# EAGLE schematic iceberg20 (EAGLE 9.5.0)
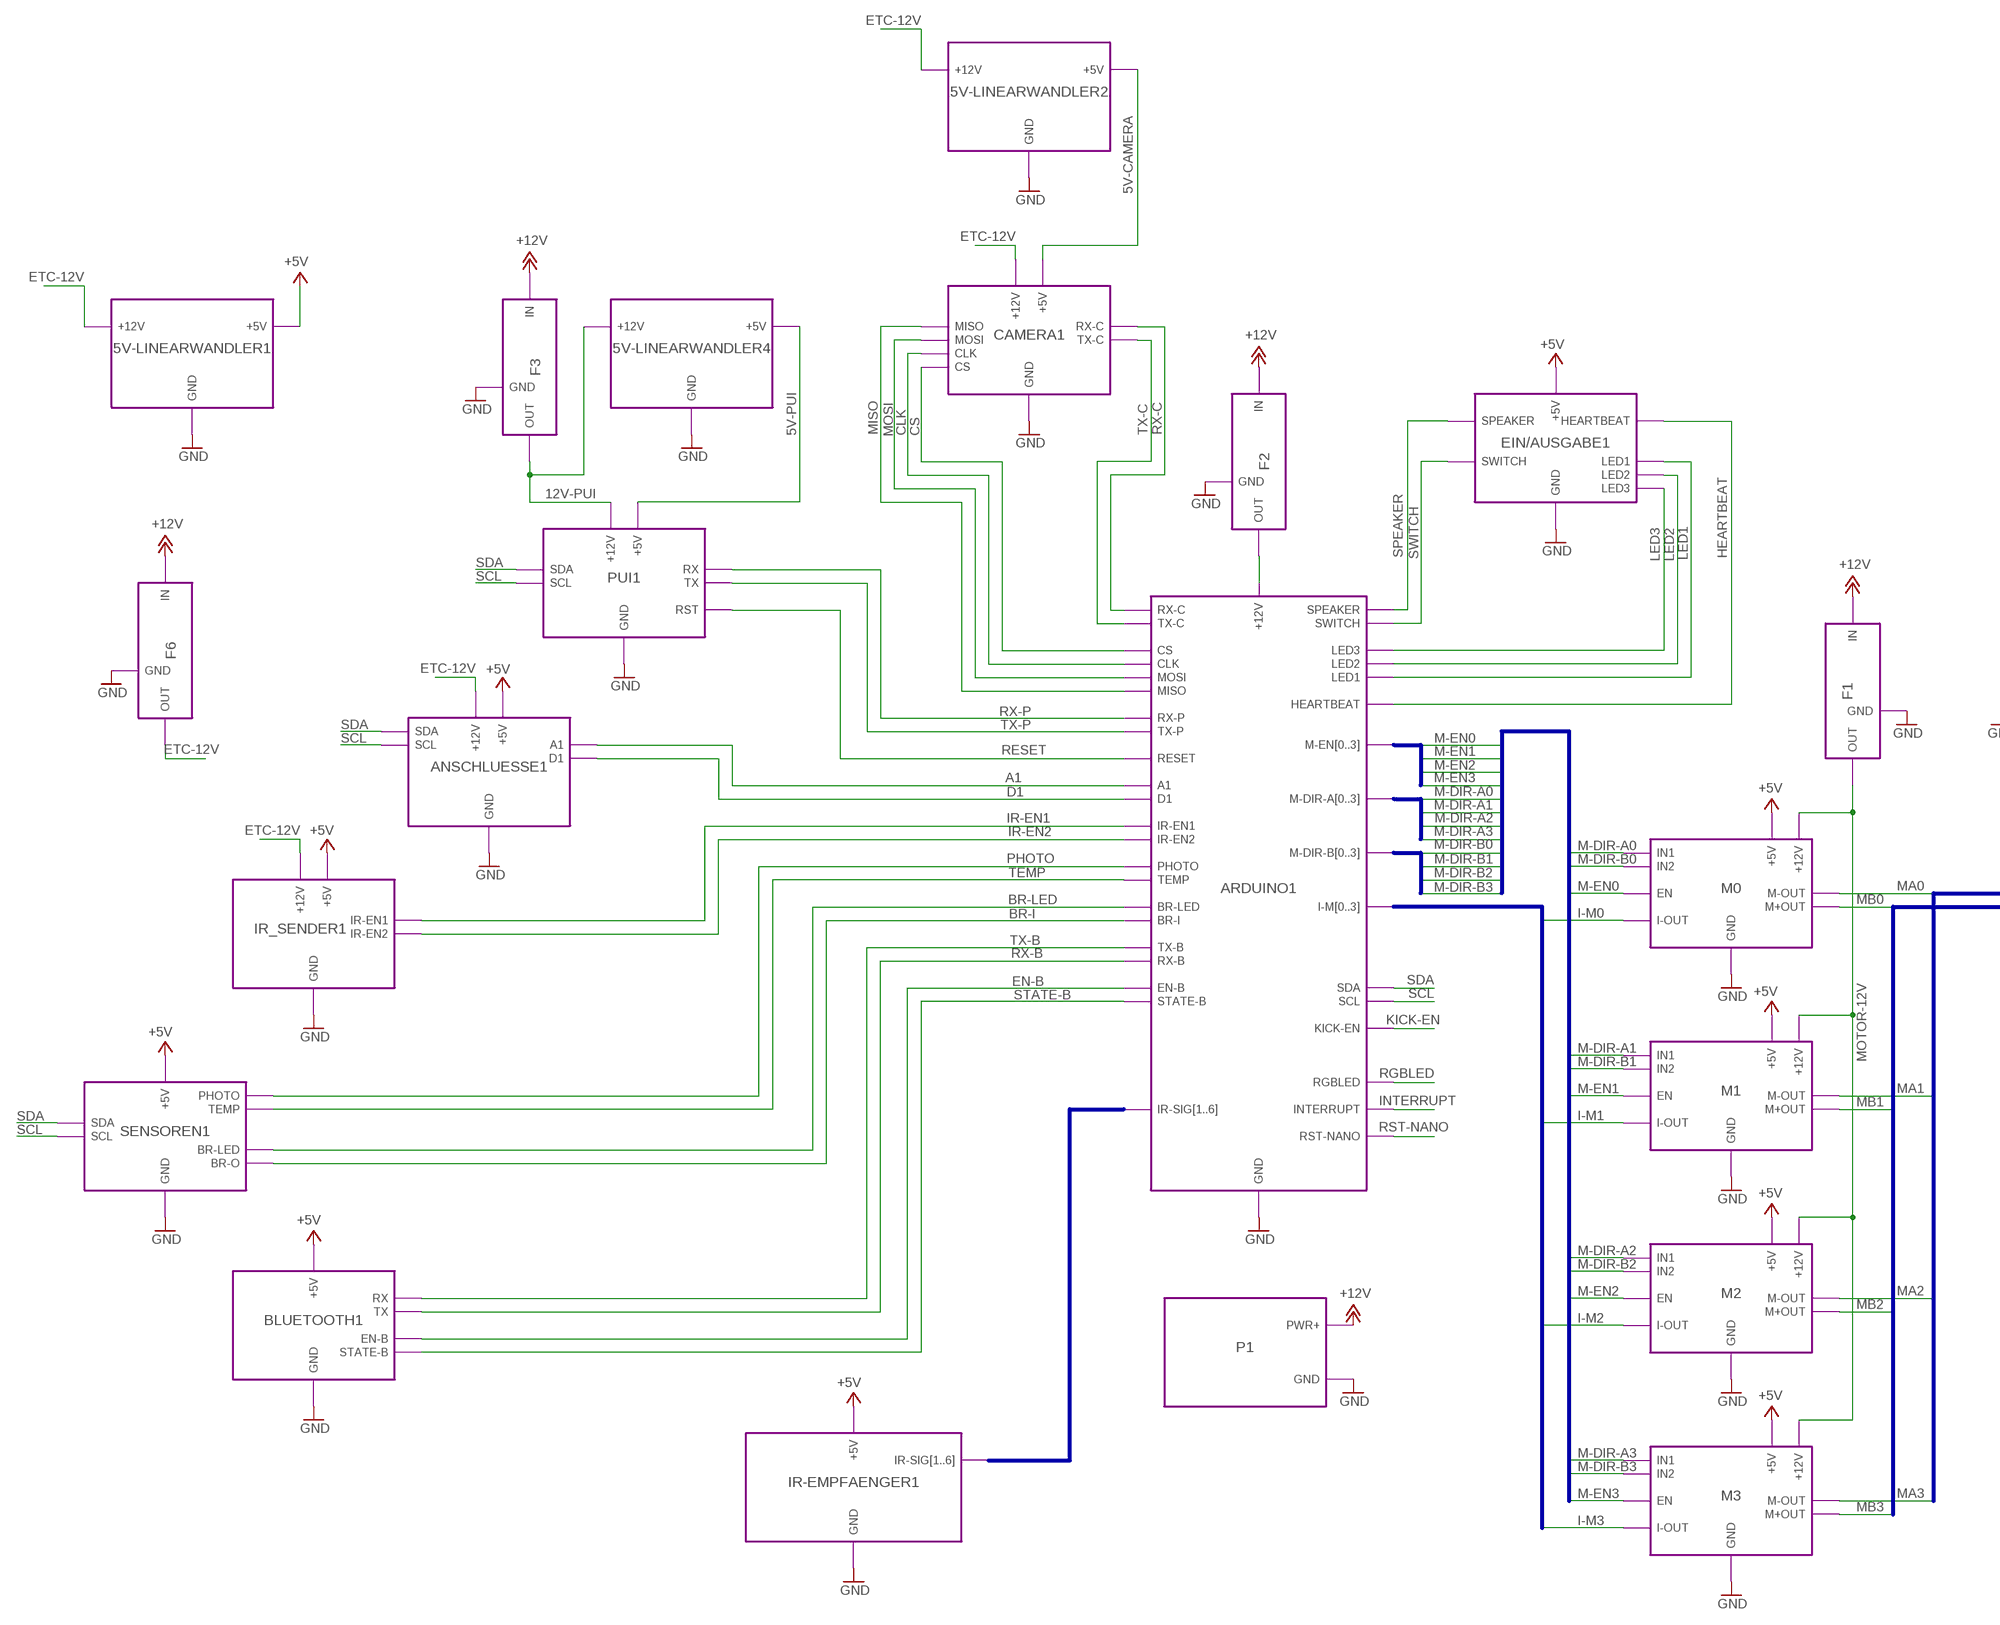
[diagram p0: schematic, sheet 1, part 1 of 2]
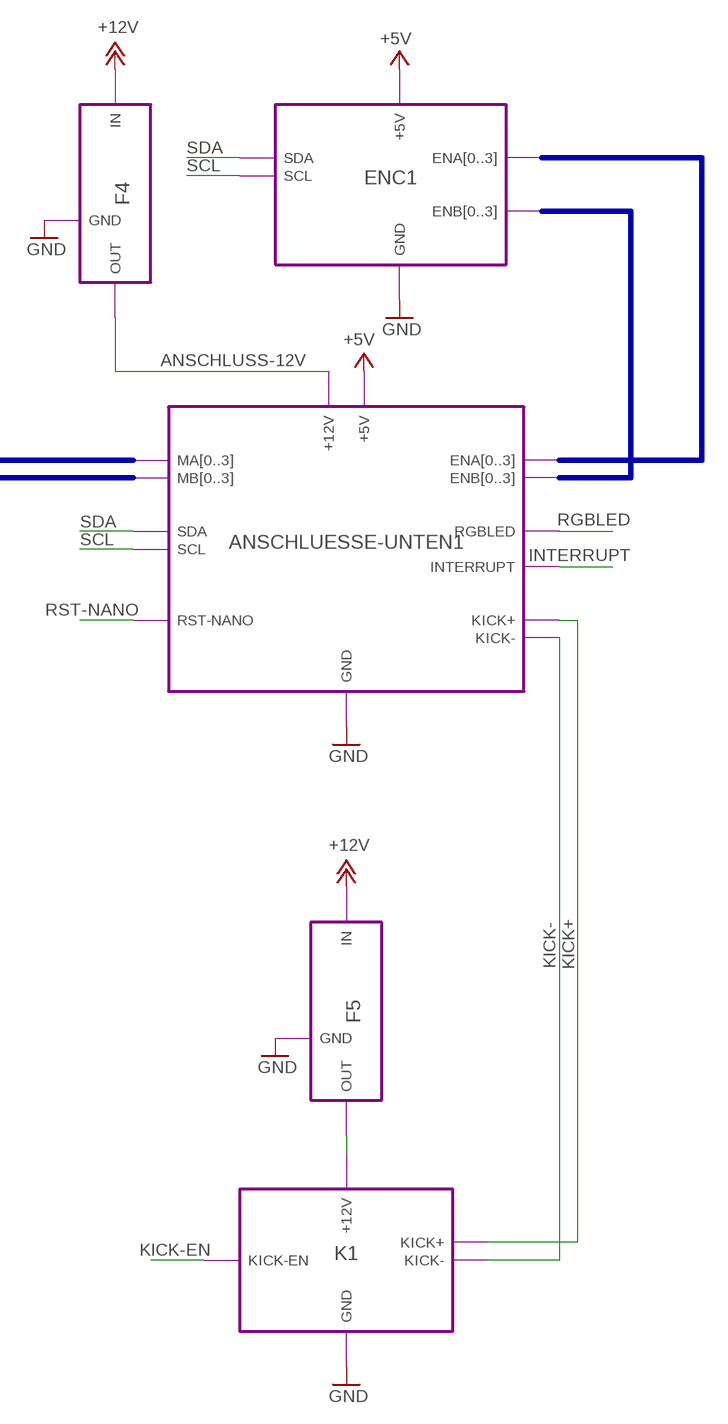
[diagram p1: schematic, sheet 1, part 2 of 2]

## Module instances
M0 = MOTOR
F1 = SICHERUNG
M1 = MOTOR
M2 = MOTOR
M3 = MOTOR
P1 = POWER
5V-LINEARWANDLER1 = 5V-LINEARWANDLER
BLUETOOTH1 = BLUETOOTH
CAMERA1 = CAMERA
IR_SENDER1 = IR-SENDER
ENC1 = ENCODER
IR-EMPFAENGER1 = IR-EMPFAENGER
K1 = KICK
PUI1 = PUI
SENSOREN1 = SENSOREN
ANSCHLUESSE-UNTEN1 = ANSCHLUESSE-UNTEN
ANSCHLUESSE1 = ANSCHLUESSE
EIN/AUSGABE1 = EIN/AUSGABE
F2 = SICHERUNG
F3 = SICHERUNG
F4 = SICHERUNG
F5 = SICHERUNG
F6 = SICHERUNG
5V-LINEARWANDLER2 = 5V-LINEARWANDLER
5V-LINEARWANDLER4 = 5V-LINEARWANDLER
ARDUINO1 = ARDUINO

## Nets
5V-CAMERA: port 5V-LINEARWANDLER2.+5V CAMERA1.+5V
5V-PUI: port 5V-LINEARWANDLER4.+5V PUI1.+5V
12V-PUI: port F3.OUT PUI1.+12V 5V-LINEARWANDLER4.+12V
+5V: port M1.+5V M2.+5V M0.+5V M3.+5V 5V-LINEARWANDLER1.+5V EIN/AUSGABE1.+5V ENC1.+5V IR-EMPFAENGER1.+5V BLUETOOTH1.+5V SENSOREN1.+5V IR_SENDER1.+5V ANSCHLUESSE1.+5V ANSCHLUESSE-UNTEN1.+5V
+12V: port P1.PWR+ F1.IN F2.IN F3.IN F4.IN F5.IN F6.IN
A1: port ARDUINO1.A1 ANSCHLUESSE1.A1
ANSCHLUSS-12V: port F4.OUT ANSCHLUESSE-UNTEN1.+12V
BR-I: port SENSOREN1.BR-O ARDUINO1.BR-I
BR-LED: port SENSOREN1.BR-LED ARDUINO1.BR-LED
CLK: port CAMERA1.CLK ARDUINO1.CLK
CS: port CAMERA1.CS ARDUINO1.CS
D1: port ARDUINO1.D1 ANSCHLUESSE1.D1
EN-B: port BLUETOOTH1.EN-B ARDUINO1.EN-B
ETC-12V: port ANSCHLUESSE1.+12V CAMERA1.+12V IR_SENDER1.+12V F6.OUT 5V-LINEARWANDLER1.+12V 5V-LINEARWANDLER2.+12V
GND: port M1.GND M2.GND F1.GND P1.GND M3.GND SENSOREN1.GND ANSCHLUESSE1.GND ANSCHLUESSE-UNTEN1.GND EIN/AUSGABE1.GND PUI1.GND K1.GND 5V-LINEARWANDLER1.GND IR-EMPFAENGER1.GND IR_SENDER1.GND CAMERA1.GND ENC1.GND BLUETOOTH1.GND M0.GND F2.GND F3.GND F4.GND F5.GND F6.GND 5V-LINEARWANDLER2.GND 5V-LINEARWANDLER4.GND ARDUINO1.GND
HEARTBEAT: port EIN/AUSGABE1.HEARTBEAT ARDUINO1.HEARTBEAT
I-M0: port M0.I-OUT
I-M1: port M1.I-OUT
I-M2: port M2.I-OUT
I-M3: port M3.I-OUT
INTERRUPT: port ANSCHLUESSE-UNTEN1.INTERRUPT ARDUINO1.INTERRUPT
IR-EN1: port IR_SENDER1.IR-EN1 ARDUINO1.IR-EN1
IR-EN2: port IR_SENDER1.IR-EN2 ARDUINO1.IR-EN2
KICK: port F5.OUT K1.+12V
KICK+: port ANSCHLUESSE-UNTEN1.KICK+ K1.KICK+
KICK-: port ANSCHLUESSE-UNTEN1.KICK- K1.KICK-
KICK-EN: port ARDUINO1.KICK-EN K1.KICK-EN
LED1: port EIN/AUSGABE1.LED1 ARDUINO1.LED1
LED2: port EIN/AUSGABE1.LED2 ARDUINO1.LED2
LED3: port EIN/AUSGABE1.LED3 ARDUINO1.LED3
M-DIR-A0: port M0.IN1
M-DIR-A1: port M1.IN1
M-DIR-A2: port M2.IN1
M-DIR-A3: port M3.IN1
M-DIR-B0: port M0.IN2
M-DIR-B1: port M1.IN2
M-DIR-B2: port M2.IN2
M-DIR-B3: port M3.IN2
M-EN0: port M0.EN
M-EN1: port M1.EN
M-EN2: port M2.EN
M-EN3: port M3.EN
MA0: port M0.M-OUT
MA1: port M1.M-OUT
MA2: port M2.M-OUT
MA3: port M3.M-OUT
MB0: port M0.M+OUT
MB1: port M1.M+OUT
MB2: port M2.M+OUT
MB3: port M3.M+OUT
MISO: port CAMERA1.MISO ARDUINO1.MISO
MOSI: port CAMERA1.MOSI ARDUINO1.MOSI
MOTOR-12V: port F1.OUT M2.+12V M3.+12V M1.+12V M0.+12V
N$38: port F2.OUT ARDUINO1.+12V
PHOTO: port SENSOREN1.PHOTO ARDUINO1.PHOTO
RESET: port PUI1.RST ARDUINO1.RESET
RGBLED: port ANSCHLUESSE-UNTEN1.RGBLED ARDUINO1.RGBLED
RST-NANO: port ARDUINO1.RST-NANO ANSCHLUESSE-UNTEN1.RST-NANO
RX-B: port BLUETOOTH1.TX ARDUINO1.RX-B
RX-C: port CAMERA1.RX-C ARDUINO1.RX-C
RX-P: port PUI1.RX ARDUINO1.RX-P
SCL: port ENC1.SCL SENSOREN1.SCL ANSCHLUESSE1.SCL ANSCHLUESSE-UNTEN1.SCL PUI1.SCL ARDUINO1.SCL
SDA: port ENC1.SDA SENSOREN1.SDA ANSCHLUESSE1.SDA ANSCHLUESSE-UNTEN1.SDA PUI1.SDA ARDUINO1.SDA
SPEAKER: port EIN/AUSGABE1.SPEAKER ARDUINO1.SPEAKER
STATE-B: port ARDUINO1.STATE-B BLUETOOTH1.STATE-B
SWITCH: port EIN/AUSGABE1.SWITCH ARDUINO1.SWITCH
TEMP: port ARDUINO1.TEMP SENSOREN1.TEMP
TX-B: port BLUETOOTH1.RX ARDUINO1.TX-B
TX-C: port CAMERA1.TX-C ARDUINO1.TX-C
TX-P: port PUI1.TX ARDUINO1.TX-P

## Buses
MB[0..3]
ENA[0..3]
ENB[0..3]
MA[0..3]
IR-SIG[1..6]
M-EN[0..3]
M-DIR-A[0..3]
M-DIR-A[0..3],M-DIR-B[0..3],M-EN[0..3]
I-M[0..3]
M-DIR-B[0..3]

## Library data of the parts

## Module MOTOR
Ports: +12V(pwr) +5V(pwr) IN1(in) IN2(in) EN(in) GND(pwr) I-OUT(out) M-OUT(out) M+OUT(out)
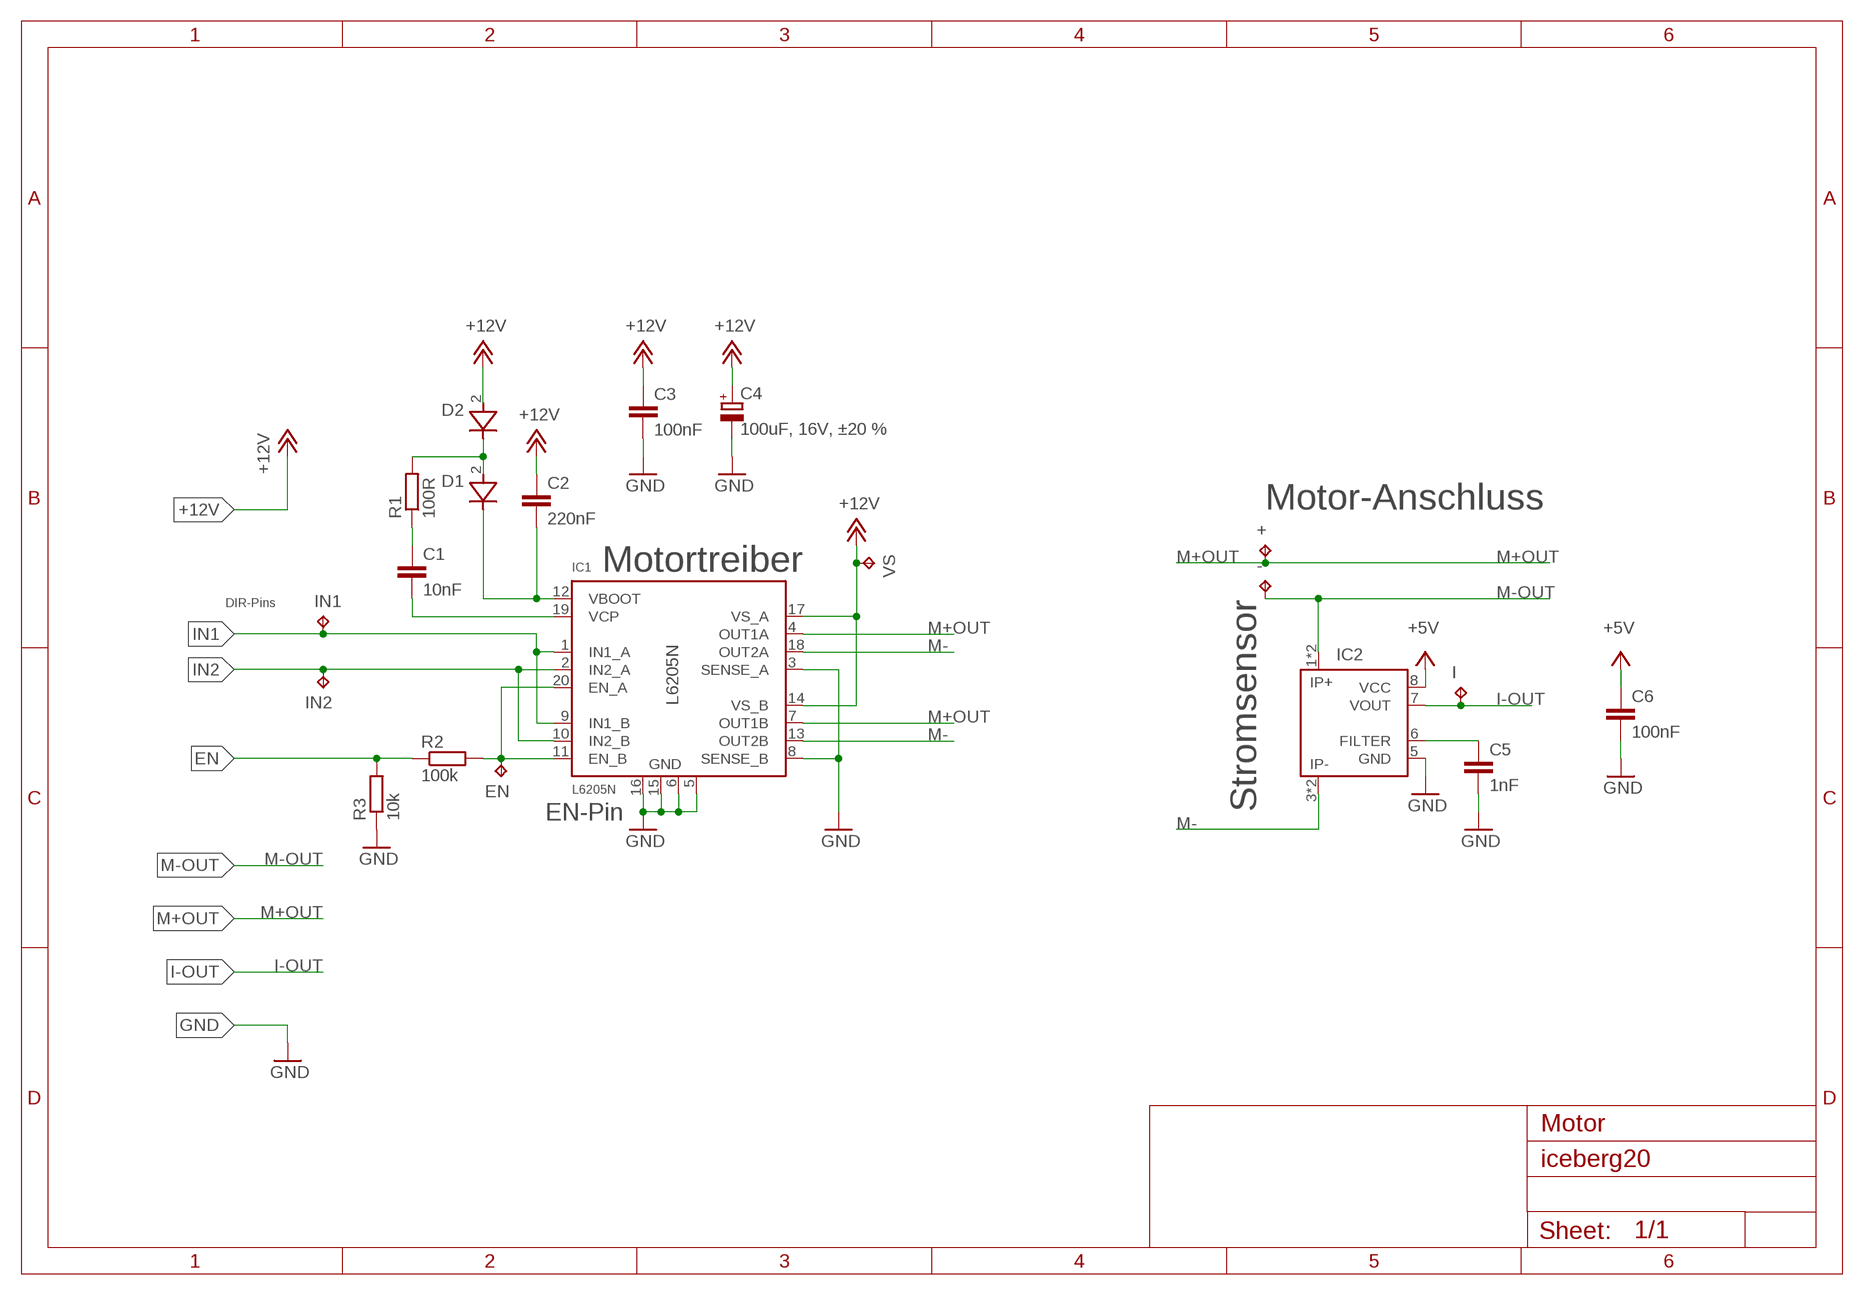
[diagram p2: schematic, module MOTOR, sheet 1]

### Parts
+  TESTPAD  [TESTPAD_B2,54]
-  TESTPAD  [TESTPAD_B2,54]
C1  10nF  C0805  [C0805]
C2  220nF  C0805  [C0805]
C3  100nF  C0805  [C0805]
C4  100uF, 16V, ±20 %  ELKO-THT-100UF  [CAPACITOR-THT-6.3]
C5  1nF  C0805  [C0805]
C6  100nF  C0805  [C0805]
D1  DIODE  [DO-214BA]
D2  DIODE  [DO-214BA]
EN  TESTPAD  [TESTPAD_B2,54]
I  TESTPAD  [TESTPAD_B2,54]
IC1  L6205N  [DIL20]
IC2  ACS712ACS712-SOIC-8  [SOIC-8]
IN1  TESTPAD  [TESTPAD_B2,54]
IN2  TESTPAD  [TESTPAD_B2,54]
R1  100R  R  [R0805]
R2  100k  R  [R0805]
R3  10k  R  [R0805]
VS  TESTPAD  [TESTPAD_B2,54]

### Nets
+5V: C6.1 IC2.8(VCC)
+12V [4A]: C2.1 C3.1 C4.1(+) D2.2(A) IC1.14(VS_B) IC1.17(VS_A) VS.TP
EN: R2.1 R3.2
FILTER: C5.1 IC2.6(FILTER)
GND [4A]: C3.2 C4.2(-) C5.2 C6.2 IC1.3(SENSE_A) IC1.5(GND) IC1.6(GND) IC1.8(SENSE_B) IC1.15(GND) IC1.16(GND) IC2.5(GND) R3.1
I-OUT: I.TP IC2.7(VOUT)
IN1 [signal]: IC1.1(IN1_A) IC1.9(IN1_B) IN1.TP
IN2 [signal]: IC1.2(IN2_A) IC1.10(IN2_B) IN2.TP
M+OUT: +.TP IC1.4(OUT1A) IC1.7(OUT1B)
M- [4A]: IC1.13(OUT2B) IC1.18(OUT2A) IC2.3(IP-) IC2.4(IP-)
M-OUT: -.TP IC2.1(IP+) IC2.2(IP+)
N$4: D1.2(A) D2.1(C) R1.2
N$6: C2.2 D1.1(C) IC1.12(VBOOT)
N$7: C1.1 R1.1
N$8: C1.2 IC1.19(VCP)
N$9: EN.TP IC1.11(EN_B) IC1.20(EN_A) R2.2

### Notes on the sheet
- Motor-Anschluss
- Motortreiber
- DIR-Pins
- Stromsensor
- EN-Pin
- Motor

### Library data of the parts
+ - EN I IN1 IN2 VS = iceberg20:TESTPAD: Testpad; BESTAND: -; HERSTELLER: -; HERSTELLER-NR: -; SUPPLIER: -; SUPPLIER-NR: -
C1-C3 C5 C6 = iceberg20:C: Capacitor, SMD 0805, Value wird festgelegt; BESTAND: -; HERSTELLER: -; HERSTELLER-NR: -; SUPPLIER: -; SUPPLIER-NR: -; TOLERANZ: 10%; V-MAX: 20V
C4 = iceberg20:ELKO: Aluminium-Elko 4,7 µF, 16 V, ±20%, 3x5 mm Datenblatt: Link <https://https://www.buerklin.com/medias/sys_master/root/hc1/h62/8875244388382/8875244388382.pdf>; BESTAND: 10; HERSTELLER: Teapo; HERSTELLER-NR: KSE107M016S1ABE11K; SUPPLIER: Bürklin; SUPPLIER-NR: 11D5002
D1 D2 = iceberg20:DIODE: SMD-Gleichrichter-Diode, 50 V, 1 A, DO214BA Datenblatt: Link <https://www.buerklin.com/medias/sys_master/root/h18/hbc/8865944993822/8865944993822.pdf>; BESTAND: 0; HERSTELLER: Vishay; HERSTELLER-NR: 9DRGF1A67A; SUPPLIER: Bürklin; SUPPLIER-NR: 26S9150
IC1 = iceberg20:L6205: Brückentreiber, 8V - 52VDatenblatt: Link <https://cdn-reichelt.de/documents/datenblatt/A200/DS_L6205N.pdf>; BESTAND: ?; HERSTELLER: ST MICROELECTRONICS; HERSTELLER-NR: L6205N; SUPPLIER: reichelt; SUPPLIER-NR: L 6205 N
IC2 = iceberg20:ACS712: Stromsensor AC/DC, 5 V Datenblatt: Link <https://cdn-reichelt.de/documents/datenblatt/A200/ACS712.pdf>; BESTAND: ?; HERSTELLER: ALLEGRO; HERSTELLER-NR: ACS712ELCTR-05B-T; SUPPLIER: reichelt; SUPPLIER-NR: ACS712 ELCTR-05
R1-R3 = iceberg20:R: Resistor, SMD 0805, Value wird festgelegt; BESTAND: -; HERSTELLER: -; HERSTELLER-NR: -; SUPPLIER: -; SUPPLIER-NR: -; TOLERANZ: 5%

## Module SICHERUNG
Ports: IN(in) OUT(out) GND(pwr)
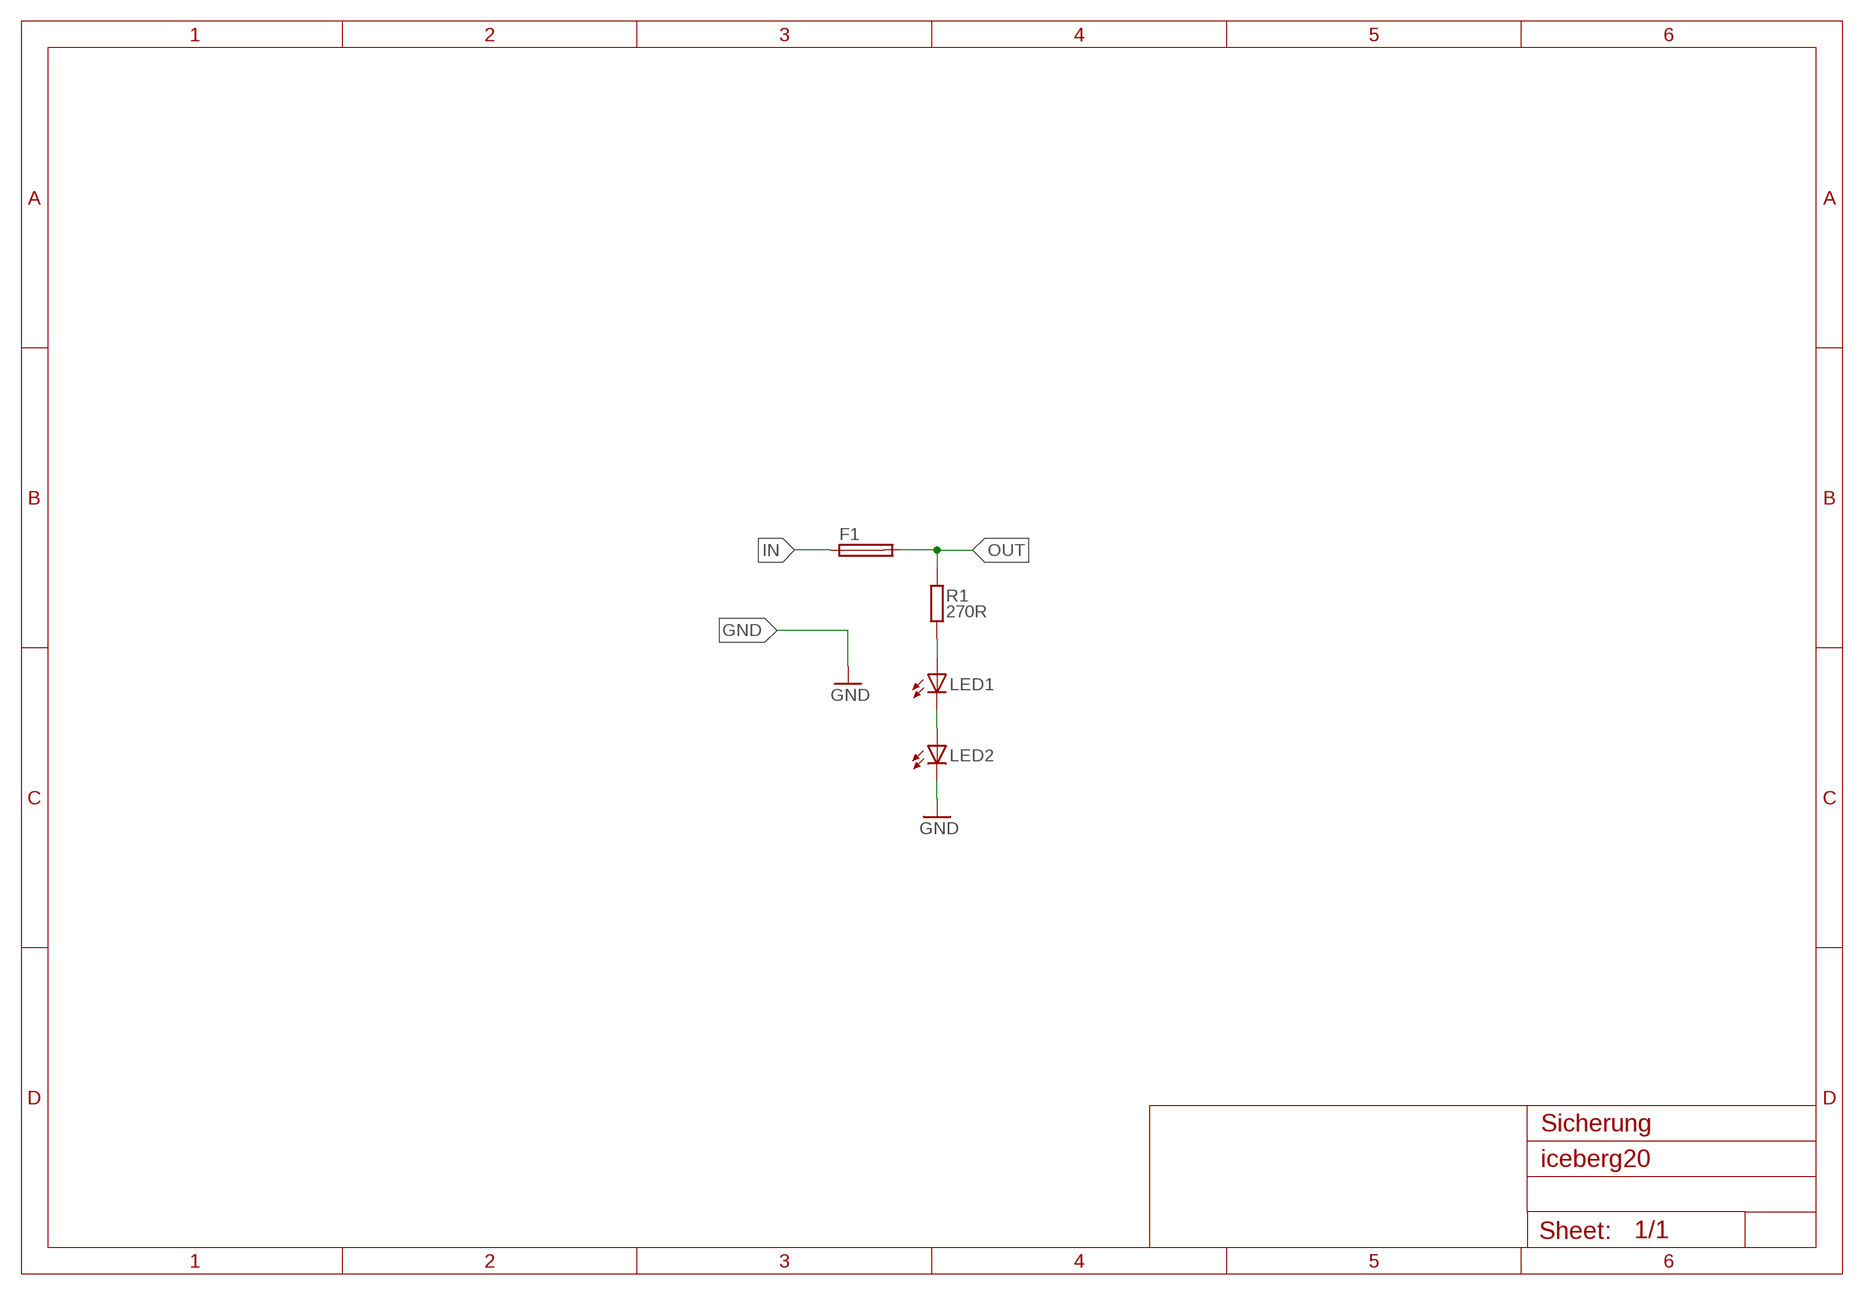
[diagram p3: schematic, module SICHERUNG, sheet 1]

### Parts
F1  SICHERUNGSHALTER  [SH22,5]
LED1  LED-GREEN1  [1206]
LED2  LED-GREEN1  [1206]
R1  270R  R  [R0805]

### Nets
GND [4A]: LED2.C
IN: F1.1
N$1: LED1.A R1.1
N$165: LED1.C LED2.A
OUT: F1.2 R1.2

### Notes on the sheet
- Sicherung

### Library data of the parts
F1 = iceberg20:SICHERUNGSHALTER: Sicherungshalter, 250 V, 10 A Datenblatt: Link <https://www.buerklin.com/medias/sys_master/root/he1/h38/8868100440094/8868100440094.pdf>; BESTAND: ?; HERSTELLER: SCHURTER; HERSTELLER-NR: 0031.8201; SUPPLIER: Bürklin; SUPPLIER-NR: 46G6020
LED1 LED2 = iceberg20:LED-GREEN1: LED Green, 1206Datenblatt: Link <https://www.buerklin.com/medias/sys_master/root/h40/hdf/8866310357022/8866310357022.pdf>; HERSTELLER: EVERLIGHT; HERSTELLER-NR: 15-21SYGC/S530-E1/TR8 Everlight; SUPPLIER: Bürklin; SUPPLIER-NR: 67S2004
R1 = iceberg20:R: Resistor, SMD 0805, Value wird festgelegt; BESTAND: -; HERSTELLER: -; HERSTELLER-NR: -; SUPPLIER: -; SUPPLIER-NR: -; TOLERANZ: 5%

## Module ARDUINO
Ports: +12V(pwr) GND(pwr) A1(io) D1(io) SDA(io) SCL(io) KICK-EN(out) RX-P(in) TX-P(out) RESET(in) RX-B(in) TX-B(out) RX-C(in) TX-C(out) MISO(in) MOSI(out) CLK(io) CS(out) HEARTBEAT(out) IR-EN1(out) IR-EN2(out) BR-LED(out) BR-I(in) IR-SIG[1..6](in) M-EN[0..3](out) M-DIR-A[0..3](out) M-DIR-B[0..3](out) I-M[0..3](in) RGBLED(out) INTERRUPT(in) RST-NANO(out) PHOTO(in) TEMP(in) EN-B(out) STATE-B(in) SPEAKER(out) SWITCH(in) LED3(out) LED2(out) LED1(out)
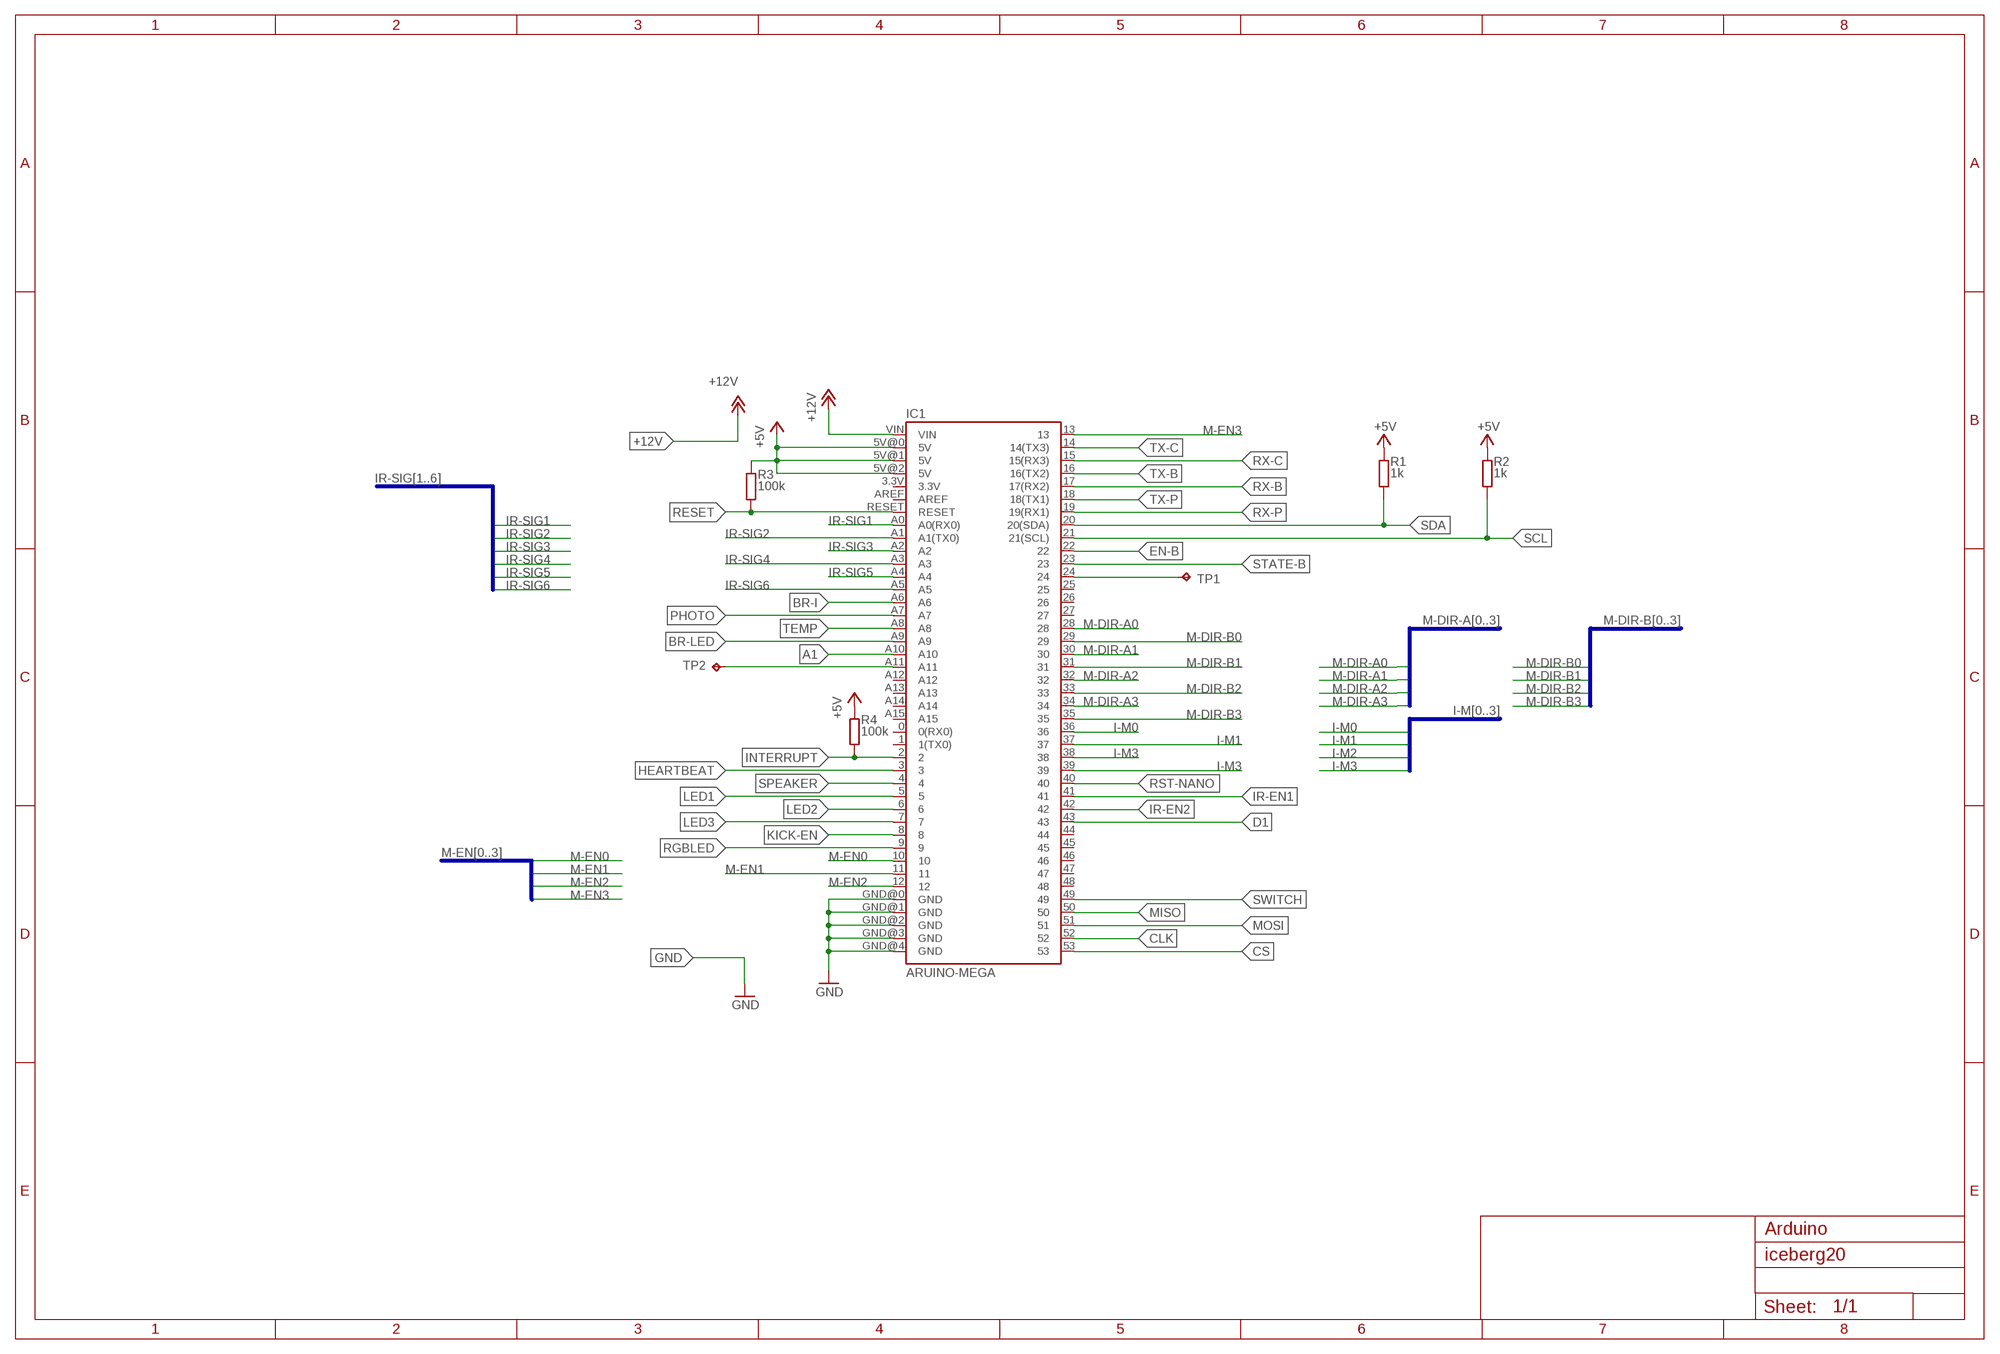
[diagram p4: schematic, module ARDUINO, sheet 1]

### Parts
IC1  ARUINO-MEGA  [ARDUINO_MEGA]
R1  1k  R  [R0805]
R2  1k  R  [R0805]
R3  100k  R  [R0805]
R4  100k  R  [R0805]
TP1  TESTPAD  [TESTPAD_B2,54]
TP2  TESTPAD  [TESTPAD_B2,54]

### Nets
+5V: IC1.5V@0(5V) IC1.5V@1(5V) IC1.5V@2(5V) R1.2 R2.2 R3.2 R4.2
+12V: IC1.VIN
A1: IC1.A10
BR-I: IC1.A6
BR-LED: IC1.A9
CLK: IC1.52
CS: IC1.53
D1: IC1.43
EN-B: IC1.22
GND: IC1.GND@0(GND) IC1.GND@1(GND) IC1.GND@2(GND) IC1.GND@3(GND) IC1.GND@4(GND)
HEARTBEAT: IC1.3
I-M0: IC1.36
I-M1: IC1.37
I-M3: IC1.38 IC1.39
INTERRUPT: IC1.2 R4.1
IR-EN1: IC1.41
IR-EN2: IC1.42
IR-SIG1: IC1.A0(A0(RX0))
IR-SIG2: IC1.A1(A1(TX0))
IR-SIG3: IC1.A2
IR-SIG4: IC1.A3
IR-SIG5: IC1.A4
IR-SIG6: IC1.A5
KICK-EN: IC1.8
LED1: IC1.5
LED2: IC1.6
LED3: IC1.7
M-DIR-A0: IC1.28
M-DIR-A1: IC1.30
M-DIR-A2: IC1.32
M-DIR-A3: IC1.34
M-DIR-B0: IC1.29
M-DIR-B1: IC1.31
M-DIR-B2: IC1.33
M-DIR-B3: IC1.35
M-EN0: IC1.10
M-EN1: IC1.11
M-EN2: IC1.12
M-EN3: IC1.13
MISO: IC1.50
MOSI: IC1.51
N$1: IC1.A11 TP2.TP
N$2: IC1.24 TP1.TP
PHOTO: IC1.A7
RESET: IC1.RESET R3.1
RGBLED: IC1.9
RST-NANO: IC1.40
RX-B: IC1.17(17(RX2))
RX-C: IC1.15(15(RX3))
RX-P: IC1.19(19(RX1))
SCL: IC1.21(21(SCL)) R2.1
SDA: IC1.20(20(SDA)) R1.1
SPEAKER: IC1.4
STATE-B: IC1.23
SWITCH: IC1.49
TEMP: IC1.A8
TX-B: IC1.16(16(TX2))
TX-C: IC1.14(14(TX3))
TX-P: IC1.18(18(TX1))
Unconnected: IC1.0(0(RX0)) IC1.1(1(TX0)) IC1.3.3V IC1.25 IC1.26 IC1.27 IC1.44 IC1.45 IC1.46 IC1.47 IC1.48 IC1.A12 IC1.A13 IC1.A14 IC1.A15 IC1.AREF

### Buses
IR-SIG[1..6]
M-DIR-A[0..3]
M-DIR-B[0..3]
I-M[0..3]
M-EN[0..3]

### Notes on the sheet
- Arduino

### Library data of the parts
IC1 = iceberg20:ARUINO-MEGA: Arudino Mega 2560, 7-12V Datenblatt: Link <https://store.arduino.cc/mega-2560-r3>; BESTAND: 4; HERSTELLER: Arduino; HERSTELLER-NR: Arduino Mega 2560; SUPPLIER: Makerstore; SUPPLIER-NR: Arduino Mega 2650
R1-R4 = iceberg20:R: Resistor, SMD 0805, Value wird festgelegt; BESTAND: -; HERSTELLER: -; HERSTELLER-NR: -; SUPPLIER: -; SUPPLIER-NR: -; TOLERANZ: 5%
TP1 TP2 = iceberg20:TESTPAD: Testpad; BESTAND: -; HERSTELLER: -; HERSTELLER-NR: -; SUPPLIER: -; SUPPLIER-NR: -

## Module POWER
Ports: PWR+(pwr) GND(pwr)
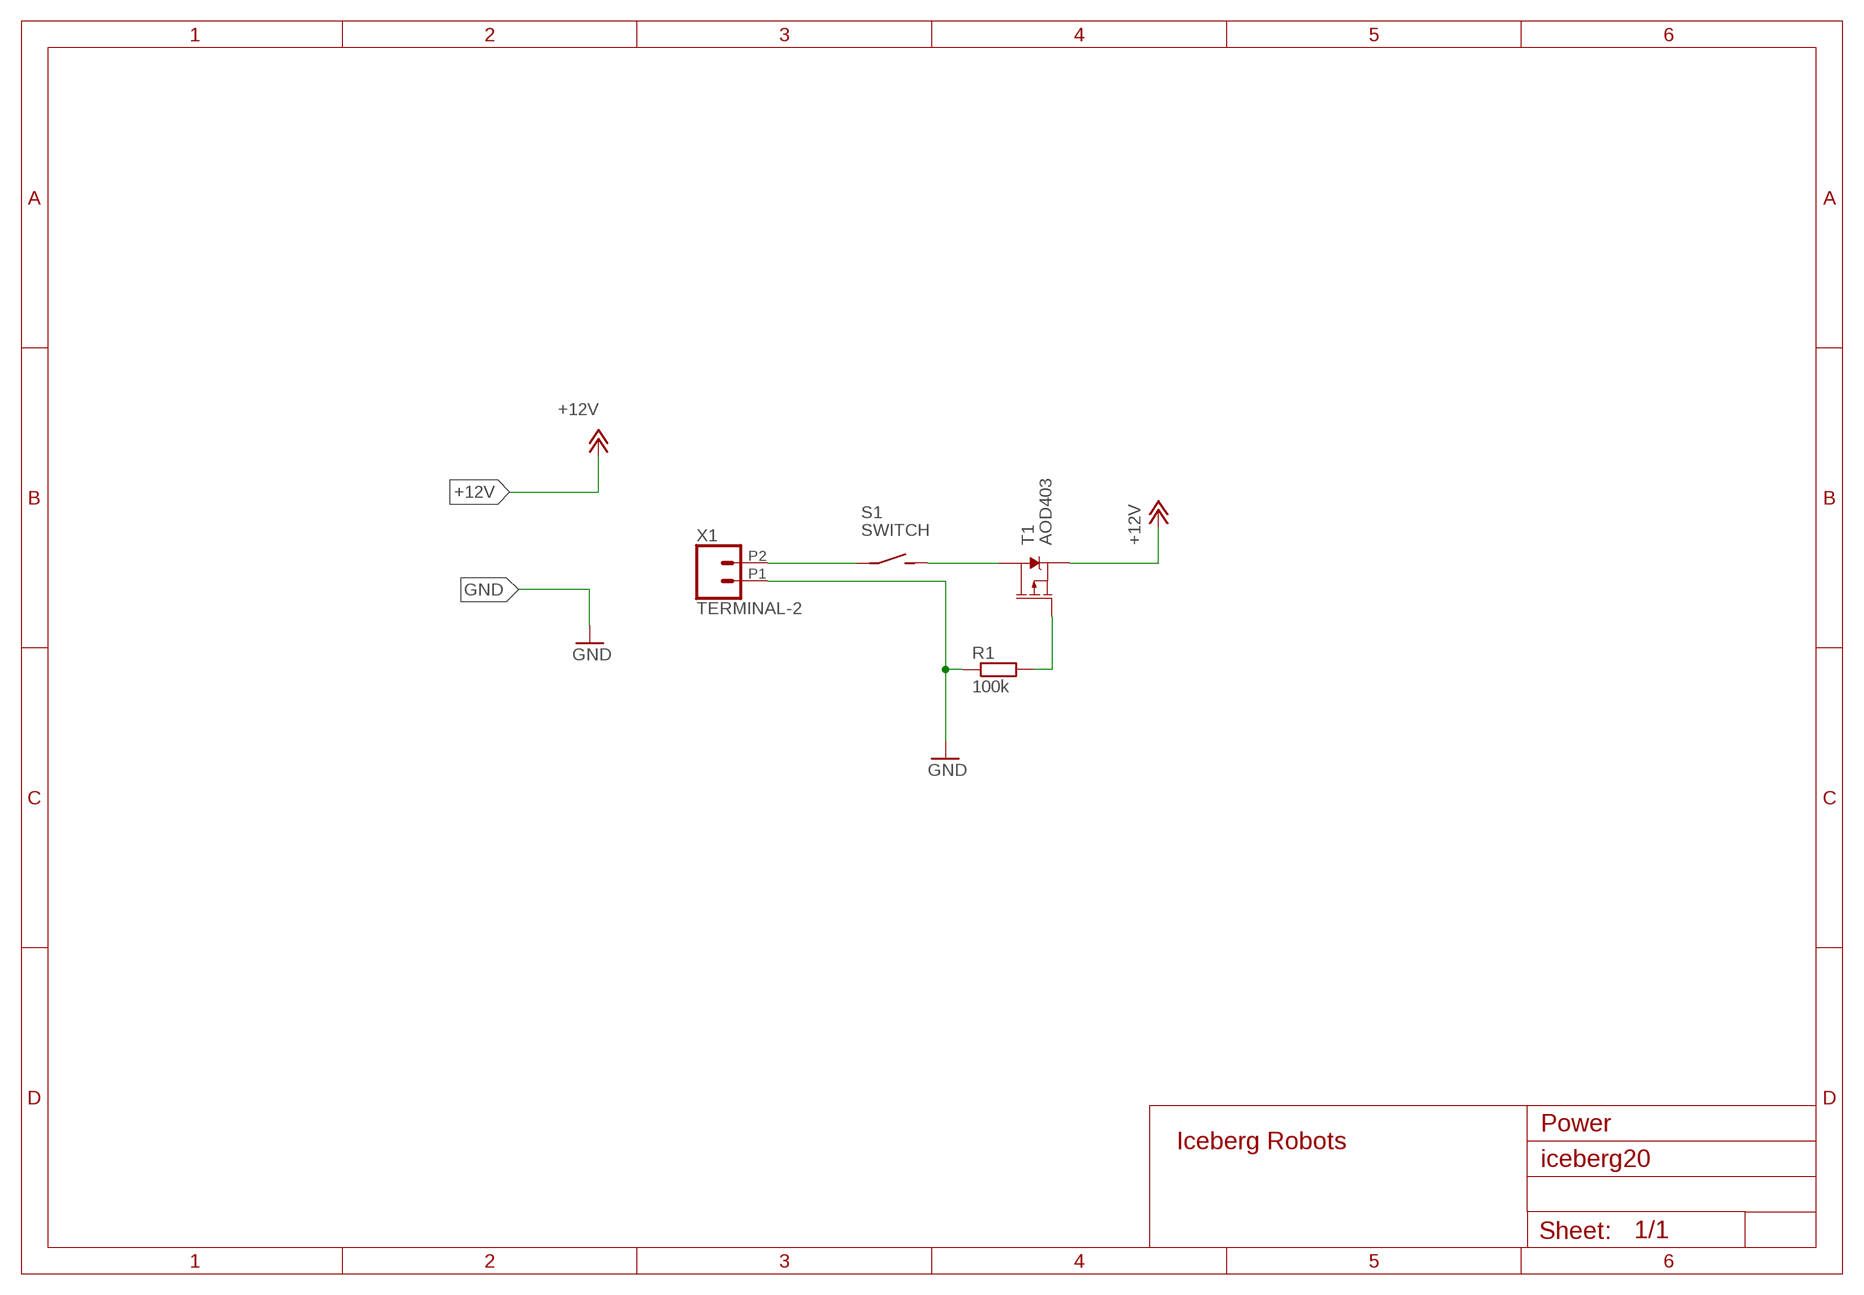
[diagram p5: schematic, module POWER, sheet 1]

### Parts
R1  100k  R  [R0805]
S1  SWITCH  [1801.2106]
T1  AOD403  [TO252]
X1  TERMINAL-2  [LIB_WECO121]

### Nets
+12V: T1.2(S)
GND: R1.1 X1.P1
N$1: S1.1(P) X1.P2
N$2: S1.2(S) T1.3(D)
N$4: R1.2 T1.1(G)

### Notes on the sheet
- Power

### Library data of the parts
R1 = iceberg20:R: Resistor, SMD 0805, Value wird festgelegt; BESTAND: -; HERSTELLER: -; HERSTELLER-NR: -; SUPPLIER: -; SUPPLIER-NR: -; TOLERANZ: 5%
S1 = iceberg20:SWITCH: Wippausschalter, schwarz, 1-polig, Ein-Aus Datenblatt: Link <https://www.buerklin.com/medias/sys_master/root/h4c/ha7/8865562296350/8865562296350.pdf>; BESTAND: 1; HERSTELLER: Marquardt; HERSTELLER-NR: 1801.2106; SUPPLIER: Bürklin; SUPPLIER-NR: 11G2420
T1 = iceberg20:AOD403: AO D403 MOSFET, P-CH, 30V, 70A, 90W, DPAK Datenblatt: Link <https://cdn-reichelt.de/documents/datenblatt/A100/AOD403_SPEC.pdf> Zeichnung: Link <http://www.aosmd.com/res/packaging_information/TO252.pdf>; BESTAND: 0; HERSTELLER: Alpha & Omega; HERSTELLER-NR: AOD403; SUPPLIER: Reichelt; SUPPLIER-NR: AO D403
X1 = iceberg20:TERMINAL-2: Stiftleiste, Stift, 2-polig, 5 mm Datenblatt: Link <https://www.buerklin.com/medias/sys_master/root/h54/h05/8866138259486/8866138259486.pdf>; HERSTELLER: Weco; HERSTELLER-NR: 20806102 121-M-121/02-K; SUPPLIER: Bürklin; SUPPLIER-NR: 47F1100

## Module KICK
Ports: +12V(pwr) GND(pwr) KICK+(io) KICK-(io) KICK-EN(io)
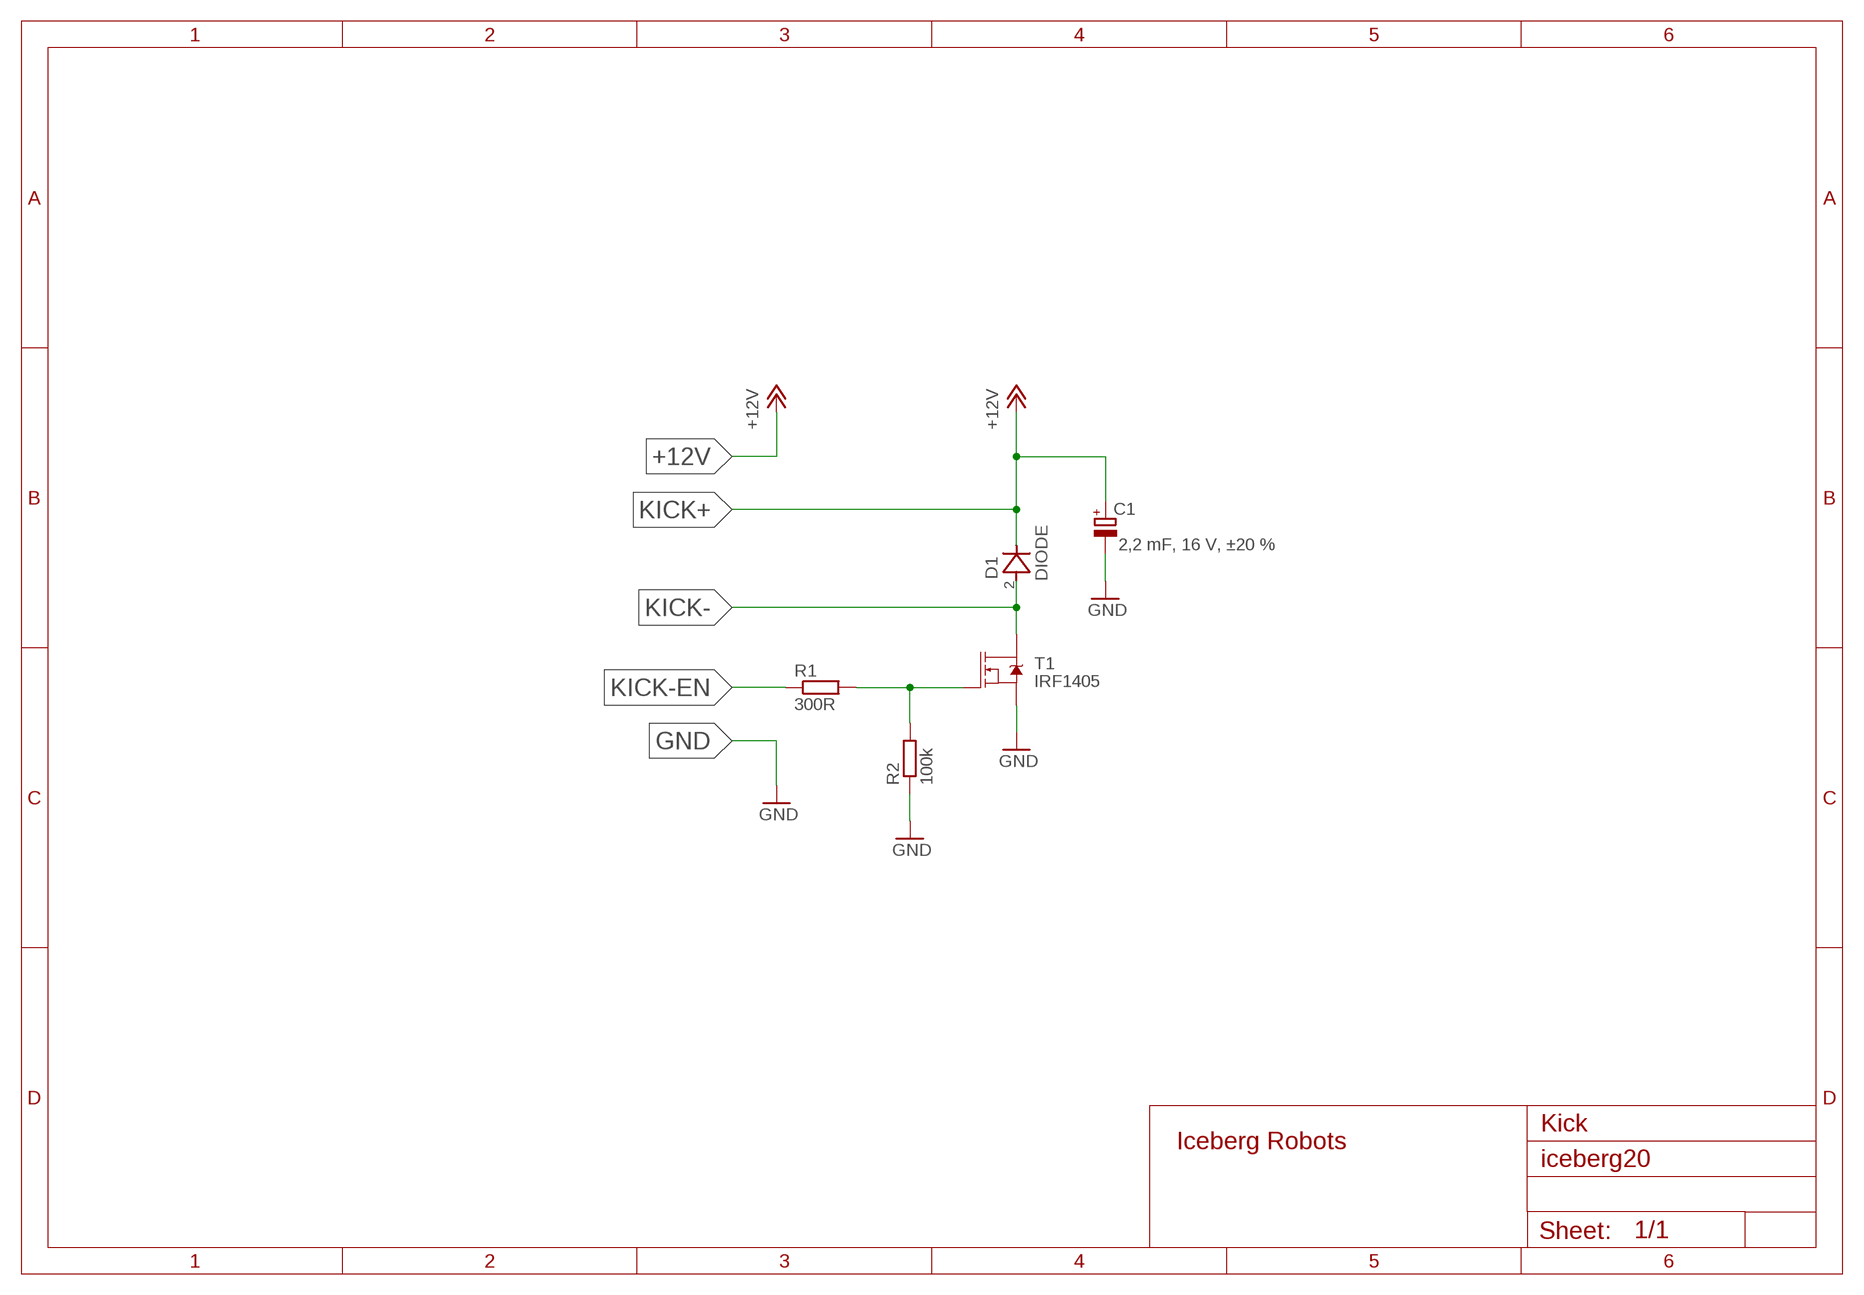
[diagram p6: schematic, module KICK, sheet 1]

### Parts
C1  2,2 mF, 16 V, ±20 %  ELKO-THT-2200UF  [CAPACITOR-THT-13]
D1  DIODE  [DO-214BA]
R1  300R  R  [R0805]
R2  100k  R  [R0805]
T1  IRF1405  [TO220V]

### Nets
GND: C1.2(-) R2.1 T1.3(S)
KICK+: C1.1(+) D1.1(C) ; supply symbol labelled +12V
KICK-: D1.2(A) T1.2(D)
KICK-EN: R1.1
N$1: R1.2 R2.2 T1.1(G)

### Notes on the sheet
- Kick

### Library data of the parts
C1 = iceberg20:ELKO: Aluminium-Elko 4,7 µF, 16 V, ±20%, 3x5 mm Datenblatt: Link <https://https://www.buerklin.com/medias/sys_master/root/hc1/h62/8875244388382/8875244388382.pdf>; BESTAND: ?; HERSTELLER: Teapo; HERSTELLER-NR: KSY228M016S1A5L25K SY2200UF/16V; SUPPLIER: Bürklin; SUPPLIER-NR: 11D5156
D1 = iceberg20:DIODE: SMD-Gleichrichter-Diode, 50 V, 1 A, DO214BA Datenblatt: Link <https://www.buerklin.com/medias/sys_master/root/h18/hbc/8865944993822/8865944993822.pdf>; BESTAND: 0; HERSTELLER: Vishay; HERSTELLER-NR: 9DRGF1A67A; SUPPLIER: Bürklin; SUPPLIER-NR: 26S9150
R1 R2 = iceberg20:R: Resistor, SMD 0805, Value wird festgelegt; BESTAND: -; HERSTELLER: -; HERSTELLER-NR: -; SUPPLIER: -; SUPPLIER-NR: -; TOLERANZ: 5%
T1 = iceberg20:IRF1405: MOSFET IRF1405PBF, N-Chanel, 169 A, THT Datenblatt: Link <https://www.buerklin.com/medias/sys_master/root/hcd/h0f/8874953441310/8874953441310.pdf/>; BESTAND: 3; HERSTELLER: IOR; HERSTELLER-NR: IRF1405PBF; SUPPLIER: Bürklin; SUPPLIER-NR: 31S3068

## Module PUI
Ports: +5V(pwr) +12V(pwr) GND(pwr) SDA(io) SCL(io) RX(in) TX(out) RST(out)
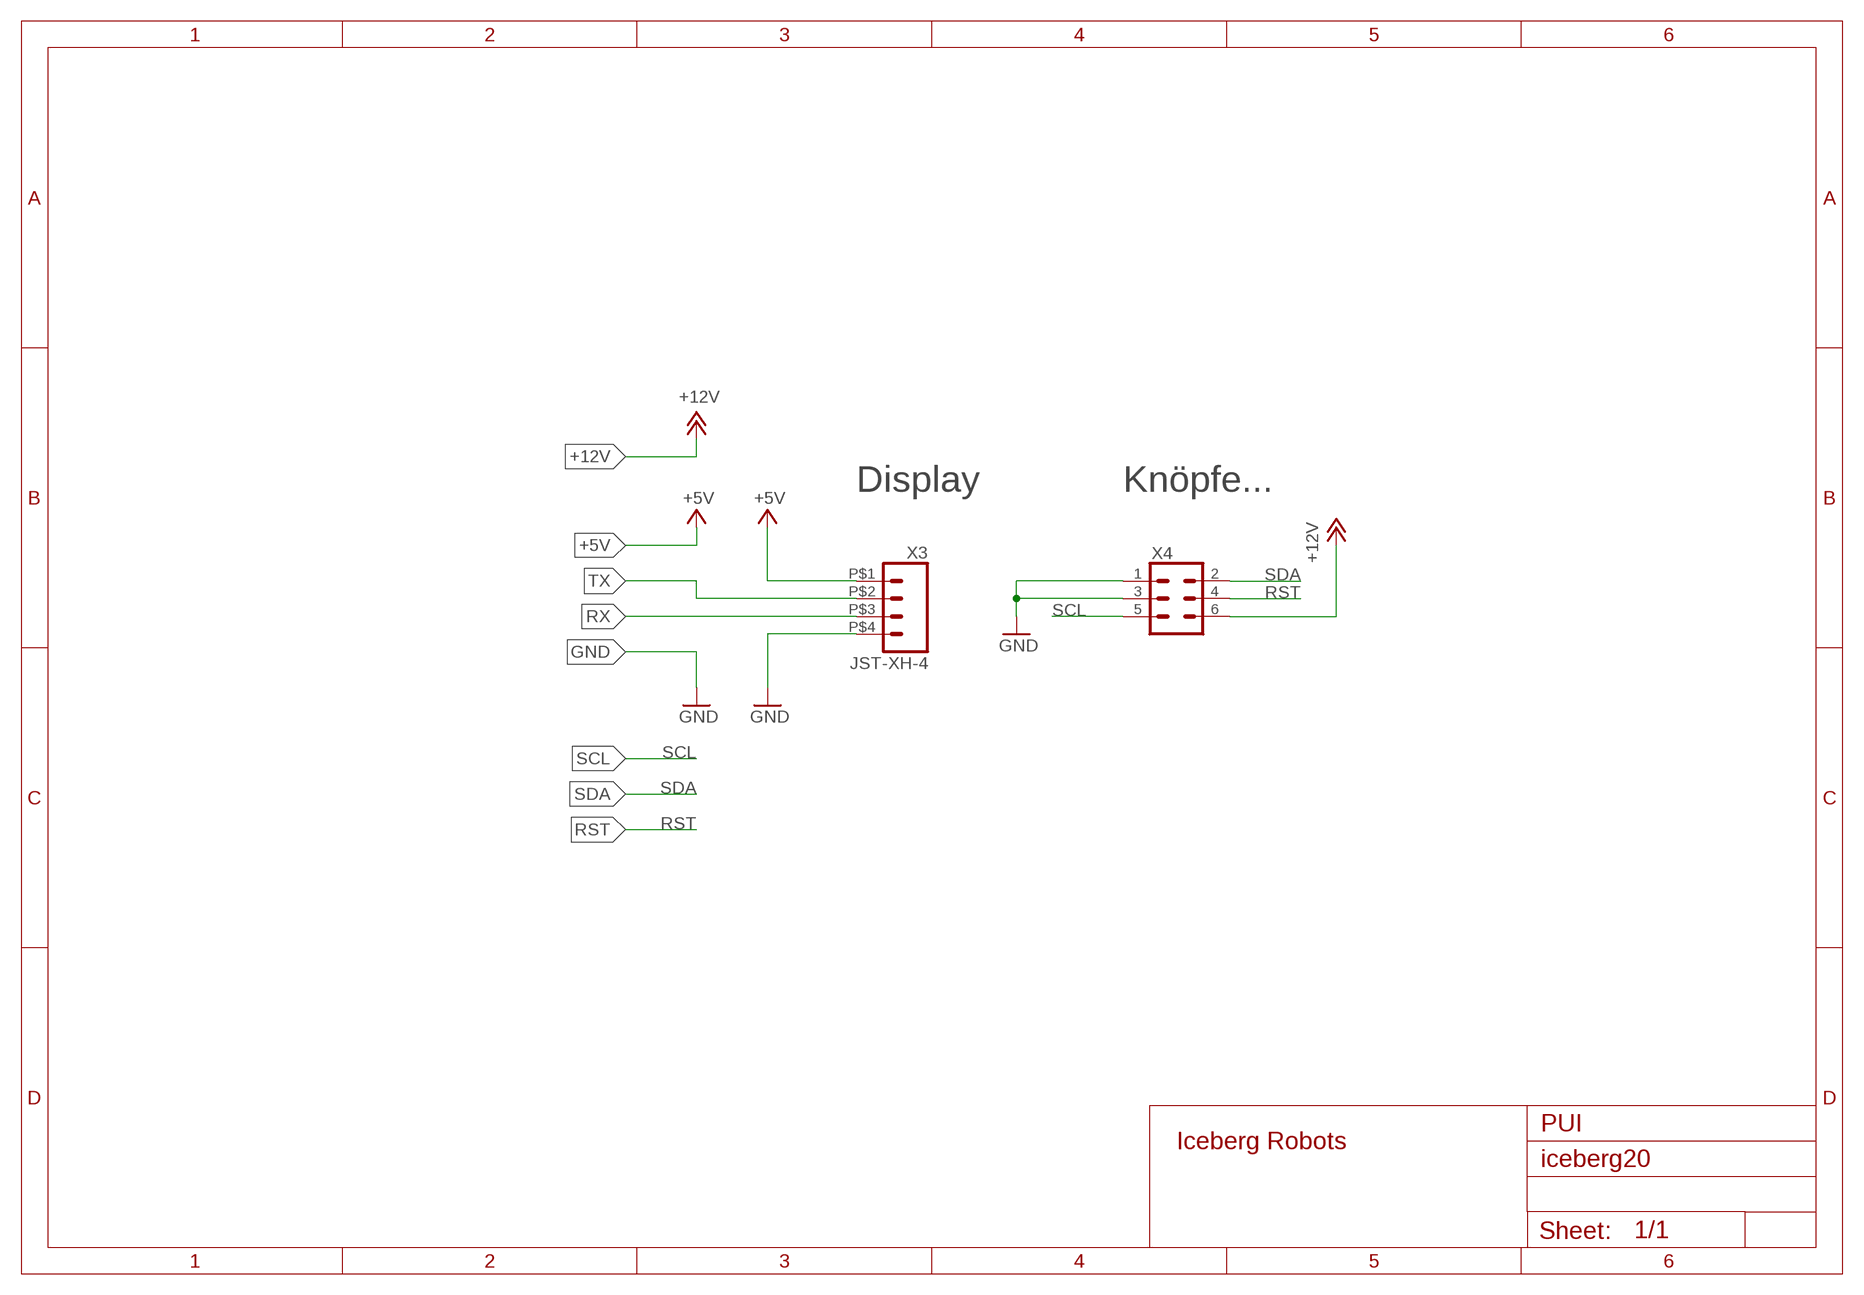
[diagram p7: schematic, module PUI, sheet 1]

### Parts
X3  JST-XH-4  [XH-4]
X4  WANNENSTECKER-6  [2X3]

### Nets
+5V: X3.P$1
+12V: X4.6
GND: X3.P$4 X4.1 X4.3
RST: X4.4
RX: X3.P$3
SCL: X4.5
SDA: X4.2
TX: X3.P$2

### Notes on the sheet
- Display | Knöpfe...
- PUI

### Library data of the parts
X3 = iceberg20:JST-XH-4: 4 Polige Buchse; JST XH; 2,50mm Datenblatt: Link <https://www.buerklin.com/medias/sys_master/root/hbc/hd1/8874985914398/8874985914398.pdf/>; BESTAND: 0; HERSTELLER: JST; HERSTELLER-NR: B4B-XH-A (LF)(SN); SUPPLIER: Bürklin; SUPPLIER-NR: 71F6408
X4 = iceberg20:WANNENSTECKER-6: Wannenbuchse(Stiftleiste) 6-Polig, 2-reihig Datenblatt: Link <https://www.buerklin.com/medias/sys_master/root/h7f/h1f/8866195406878/8866195406878.pdf>; BESTAND: 6; HERSTELLER: Harting; HERSTELLER-NR: 09185066324; SUPPLIER: Bürklin; SUPPLIER-NR: 53F4200

## Module CAMERA
Ports: +5V(pwr) +12V(pwr) CLK(io) CS(in) GND(pwr) MISO(out) MOSI(in) RX-C(in) TX-C(out)
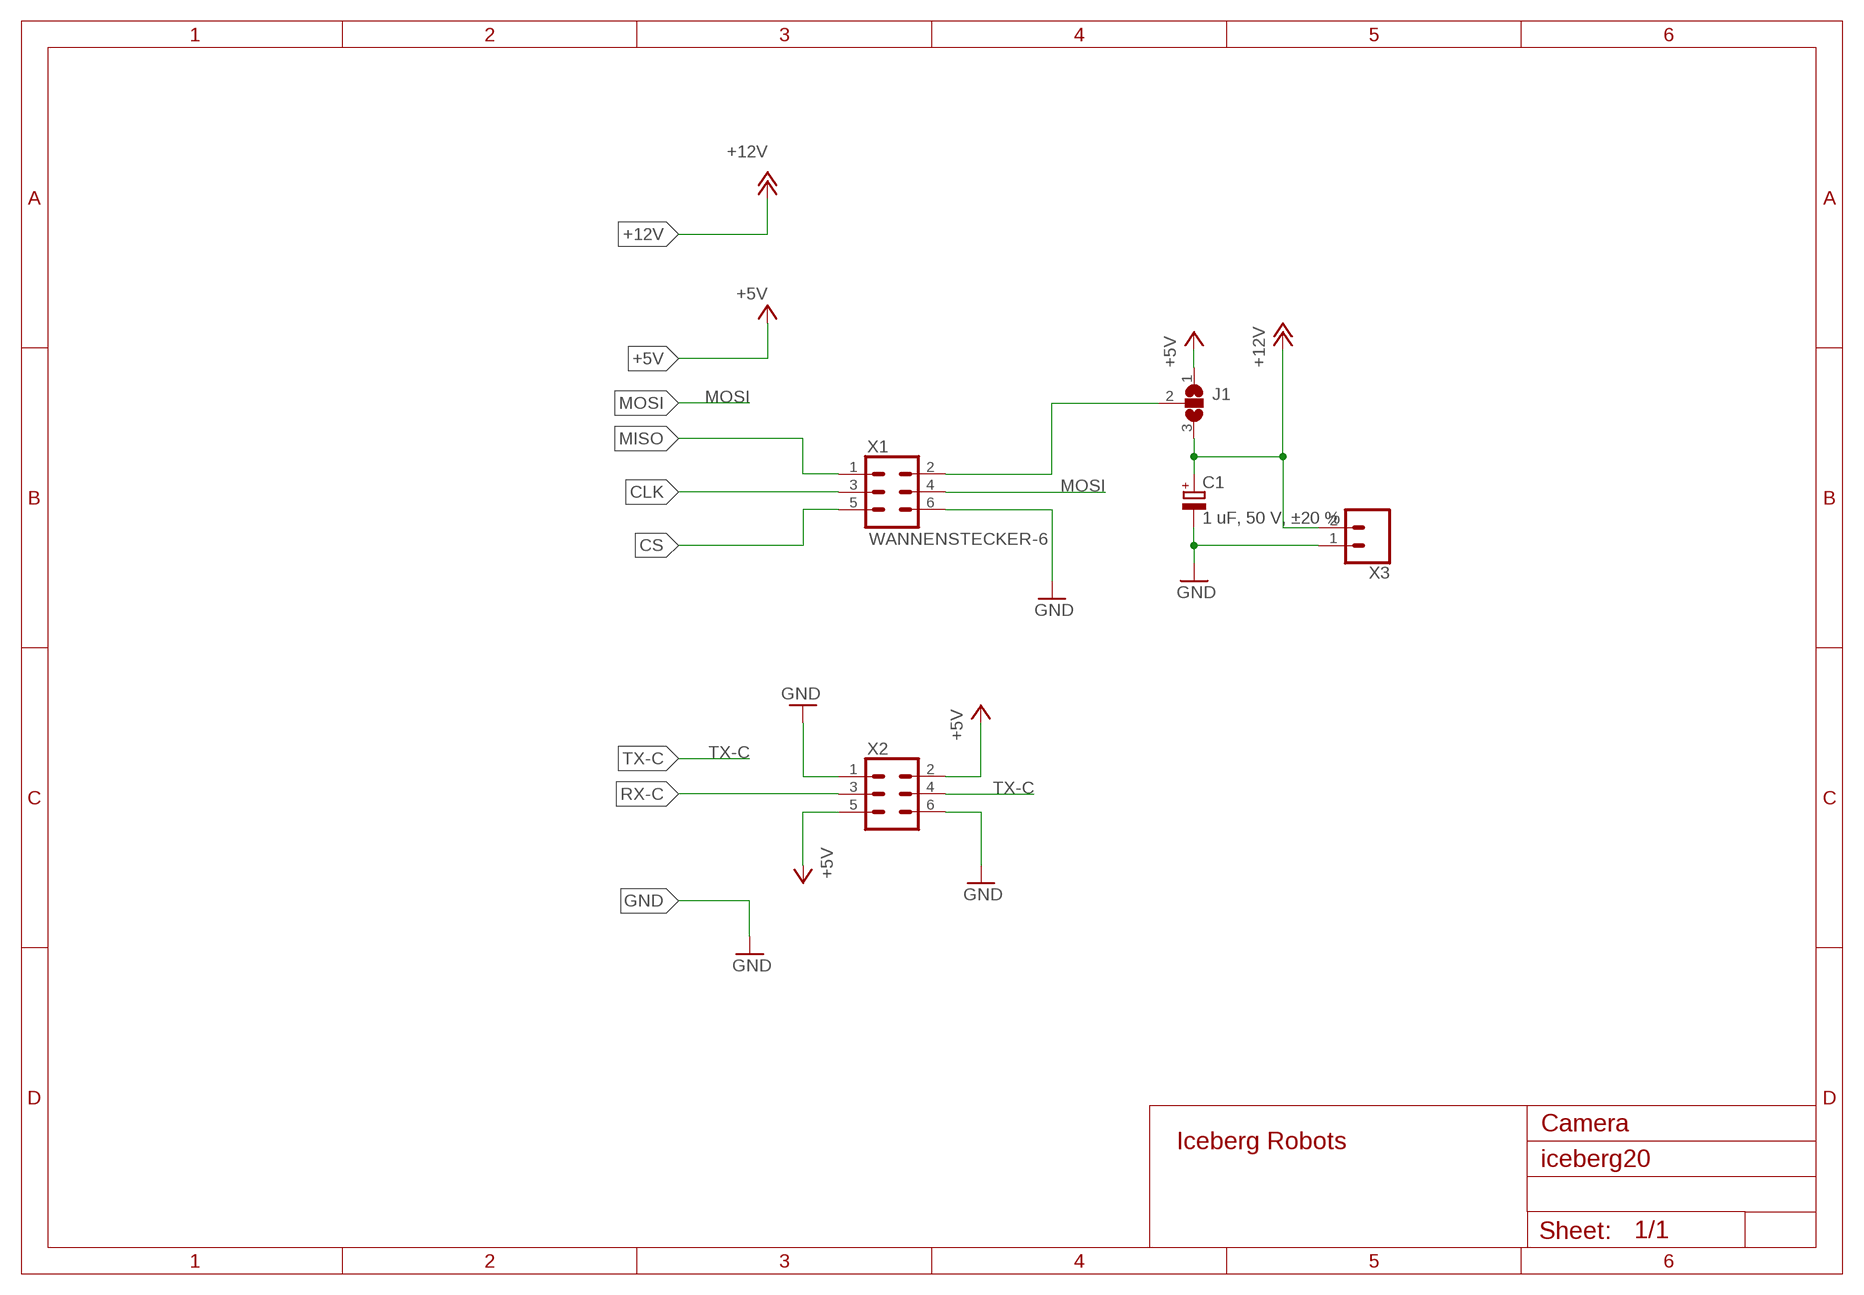
[diagram p8: schematic, module CAMERA, sheet 1]

### Parts
C1  1 uF, 50 V, ±20 %  ELKO-THT-1UF  [CAPACITOR-THT-4]
J1  JUMPER  [JUMPER-SJ-3]
X1  WANNENSTECKER-6  [2X3]
X2  WANNENSTECKER-6  [2X3]
X3  PS25/2GPS25/2GWS-1X02  [CON-01X02]

### Nets
5V-CAMERA: J1.2 X1.2
+5V: J1.1 X2.2 X2.5
+12V: C1.1(+) J1.3 X3.2
CLK: X1.3
CS: X1.5
GND: C1.2(-) X1.6 X2.1 X2.6 X3.1
MISO: X1.1
MOSI: X1.4
RX-C: X2.3
TX-C: X2.4

### Notes on the sheet
- Camera

### Library data of the parts
C1 = iceberg20:ELKO: Aluminium-Elko 4,7 µF, 16 V, ±20%, 3x5 mm Datenblatt: Link <https://https://www.buerklin.com/medias/sys_master/root/hc1/h62/8875244388382/8875244388382.pdf>; BESTAND: 10
J1 = iceberg20:JUMPER: Jumper, drei Pads Datenblatt: Link
X1 X2 = iceberg20:WANNENSTECKER-6: Wannenbuchse(Stiftleiste) 6-Polig, 2-reihig Datenblatt: Link <https://www.buerklin.com/medias/sys_master/root/h7f/h1f/8866195406878/8866195406878.pdf>; BESTAND: 6; HERSTELLER: Harting; HERSTELLER-NR: 09185066324; SUPPLIER: Bürklin; SUPPLIER-NR: 53F4200
X3 = iceberg20:PS25/2G: PS 25/2G WS Platinensteckverbinder gerade, weiß, 2-polig Datenblatt: Link; SUPPLIER: Reichelt; SUPPLIER-NR: PS 25/2G WS

## Module IR-SENDER
Ports: +12V(pwr) +5V(pwr) GND(pwr) IR-EN1(in) IR-EN2(in)
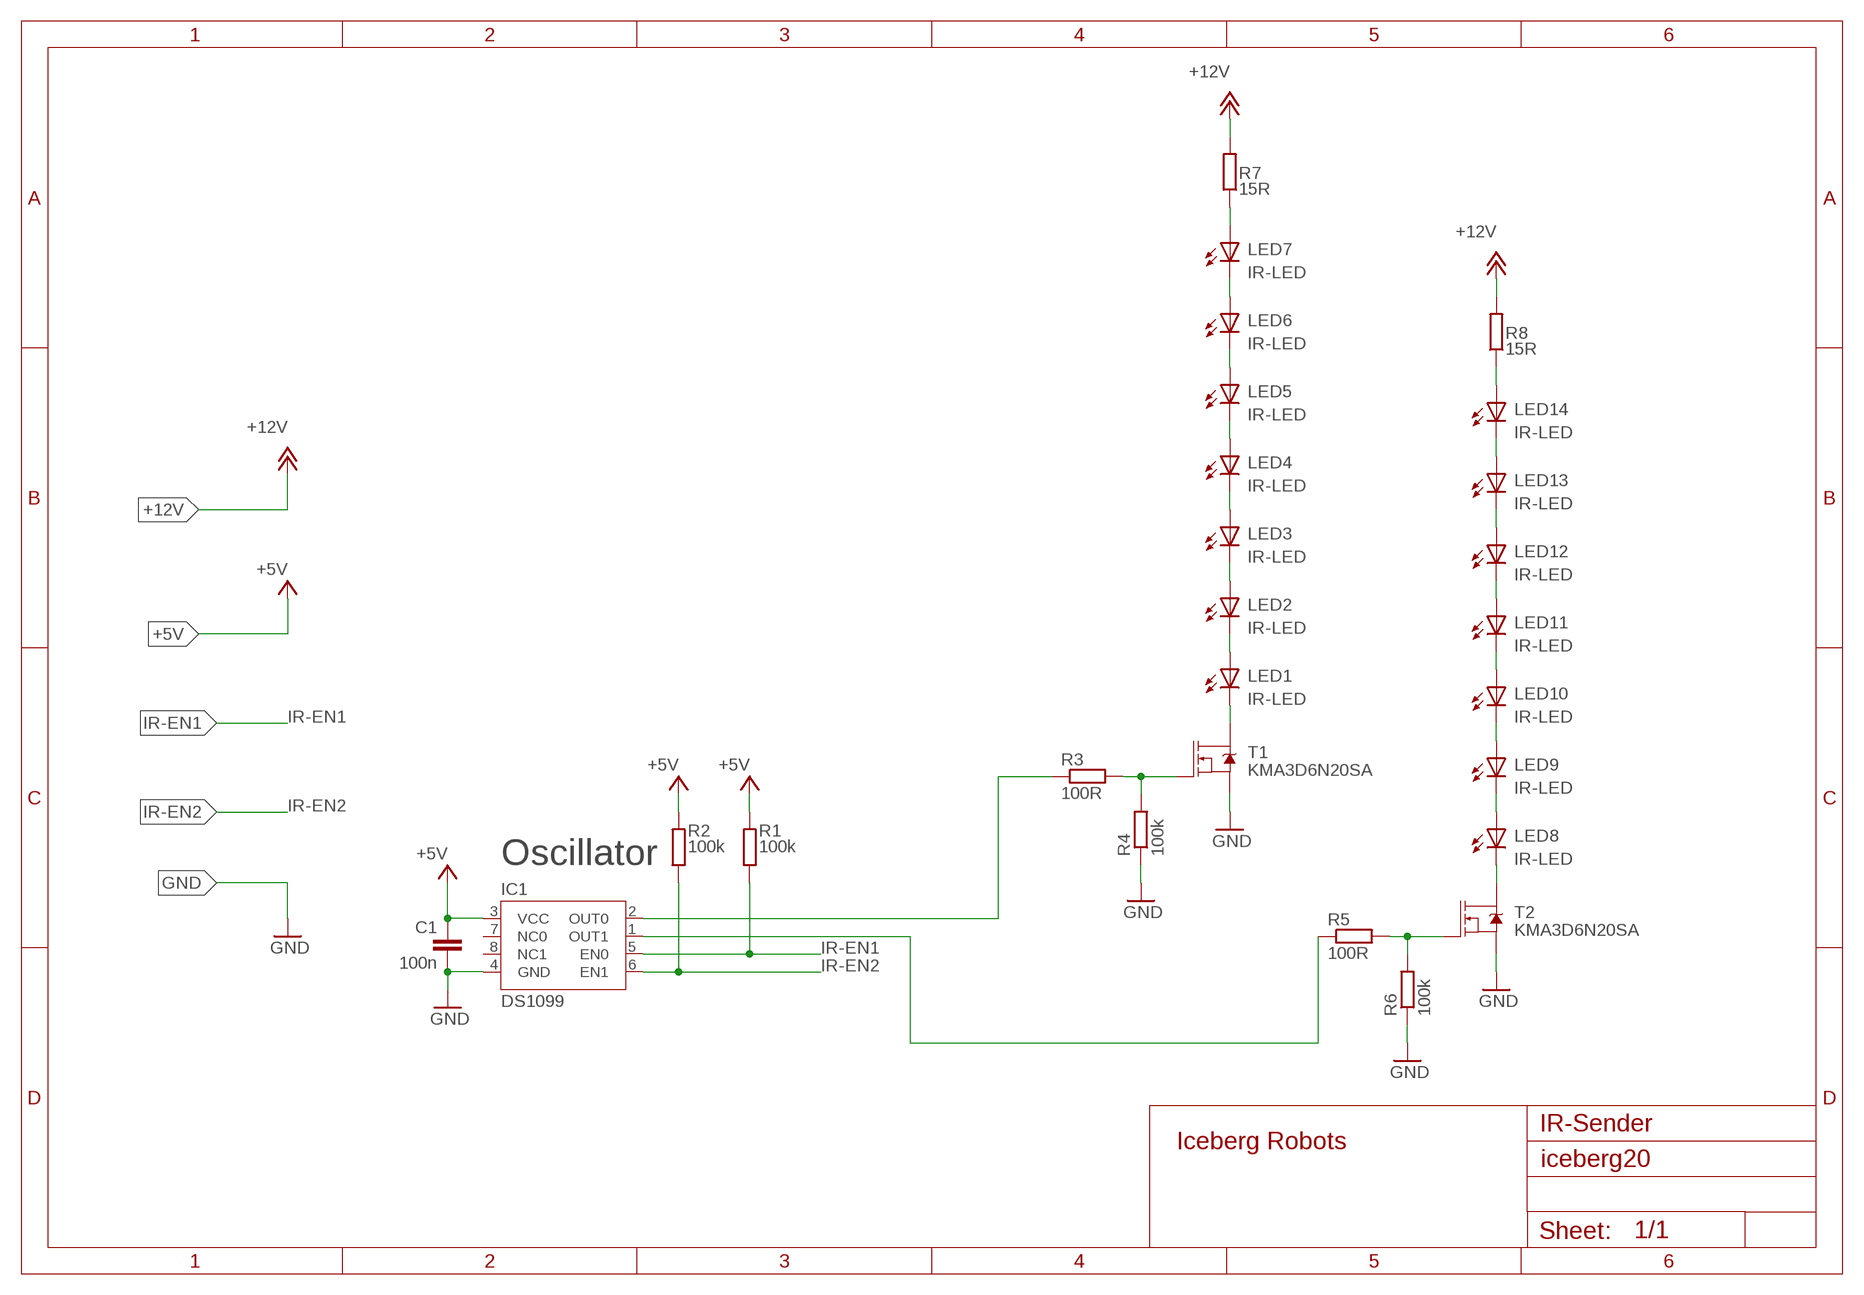
[diagram p9: schematic, module IR-SENDER, sheet 1]

### Parts
C1  100n  C0805  [C0805]
IC1  DS1099  [USOP-8]
LED1  IR-LED  [LED-3MM]
LED2  IR-LED  [LED-3MM]
LED3  IR-LED  [LED-3MM]
LED4  IR-LED  [LED-3MM]
LED5  IR-LED  [LED-3MM]
LED6  IR-LED  [LED-3MM]
LED7  IR-LED  [LED-3MM]
LED8  IR-LED  [LED-3MM]
LED9  IR-LED  [LED-3MM]
LED10  IR-LED  [LED-3MM]
LED11  IR-LED  [LED-3MM]
LED12  IR-LED  [LED-3MM]
LED13  IR-LED  [LED-3MM]
LED14  IR-LED  [LED-3MM]
R1  100k  R  [R0805]
R2  100k  R  [R0805]
R3  100R  R  [R0805]
R4  100k  R  [R0805]
R5  100R  R  [R0805]
R6  100k  R  [R0805]
R7  15R  R  [R0805]
R8  15R  R  [R0805]
T1  KMA3D6N20SA  [SOT23]
T2  KMA3D6N20SA  [SOT23]

### Nets
+5V: C1.1 IC1.3(VCC) R1.2 R2.2
+12V: R7.2 R8.2
GND: C1.2 IC1.4(GND) R4.1 R6.1 T1.1(S) T2.1(S)
IR-EN1: IC1.5(EN0) R1.1
IR-EN2: IC1.6(EN1) R2.1
N$1: R3.2 R4.2 T1.2(G)
N$2: IC1.1(OUT1) R5.1
N$3: LED1.2(C) T1.3(D)
N$4: LED1.1(A) LED2.2(C)
N$5: LED2.1(A) LED3.2(C)
N$6: LED3.1(A) LED4.2(C)
N$7: LED4.1(A) LED5.2(C)
N$8: LED5.1(A) LED6.2(C)
N$9: LED6.1(A) LED7.2(C)
N$10: R5.2 R6.2 T2.2(G)
N$11: IC1.2(OUT0) R3.1
N$12: LED8.2(C) T2.3(D)
N$13: LED8.1(A) LED9.2(C)
N$14: LED9.1(A) LED10.2(C)
N$15: LED10.1(A) LED11.2(C)
N$16: LED11.1(A) LED12.2(C)
N$17: LED12.1(A) LED13.2(C)
N$18: LED13.1(A) LED14.2(C)
N$19: LED14.1(A) R8.1
N$20: LED7.1(A) R7.1
Unconnected: IC1.7(NC0) IC1.8(NC1)

### Notes on the sheet
- Oscillator
- IR-Sender

### Library data of the parts
C1 = iceberg20:C: Capacitor, SMD 0805, Value wird festgelegt; BESTAND: -; HERSTELLER: -; HERSTELLER-NR: -; SUPPLIER: -; SUPPLIER-NR: -; TOLERANZ: 10%; V-MAX: 20V
IC1 = iceberg20:DS1099: Low-Frequenzy Oscillator 2.7V - 5.5V, 32.75 kHz Datenblatt: Link <https://www.mouser.de/datasheet/2/256/DS1099-1291827.pdf>; BESTAND: 0; HERSTELLER: Maxim Integrated; HERSTELLER-NR: DS1099U-FF+; SUPPLIER: Mouser; SUPPLIER-NR: 700-DS1099U-FF
LED1-LED14 = iceberg20:IR-LED: IR-Emitter, 950nm, 1,6V Datenblatt: Link <https://eu.mouser.com/datasheet/2/427/tsus4300-88704.pdf>; BESTAND: ?; HERSTELLER: Vishay; HERSTELLER-NR: TSAL4400; SUPPLIER: Bürklin; SUPPLIER-NR: 68S9224
R1-R8 = iceberg20:R: Resistor, SMD 0805, Value wird festgelegt; BESTAND: -; HERSTELLER: -; HERSTELLER-NR: -; SUPPLIER: -; SUPPLIER-NR: -; TOLERANZ: 5%
T1 T2 = iceberg20:KMA3D6N20SA: N-Mosfef, 3.6A, SOT23 Datenblatt: Link <https://www.buerklin.com/medias/sys_master/root/h59/hc5/8874949902366/8874949902366.pdf>; BESTAND: 0; HERSTELLER: Korea Electronics; HERSTELLER-NR: KMA3D6N20SA-RTK/P; SUPPLIER: Bürklin; SUPPLIER-NR: 24S8084

## Module IR-EMPFAENGER
Ports: +5V(pwr) GND(pwr) IR-SIG[1..6](out)
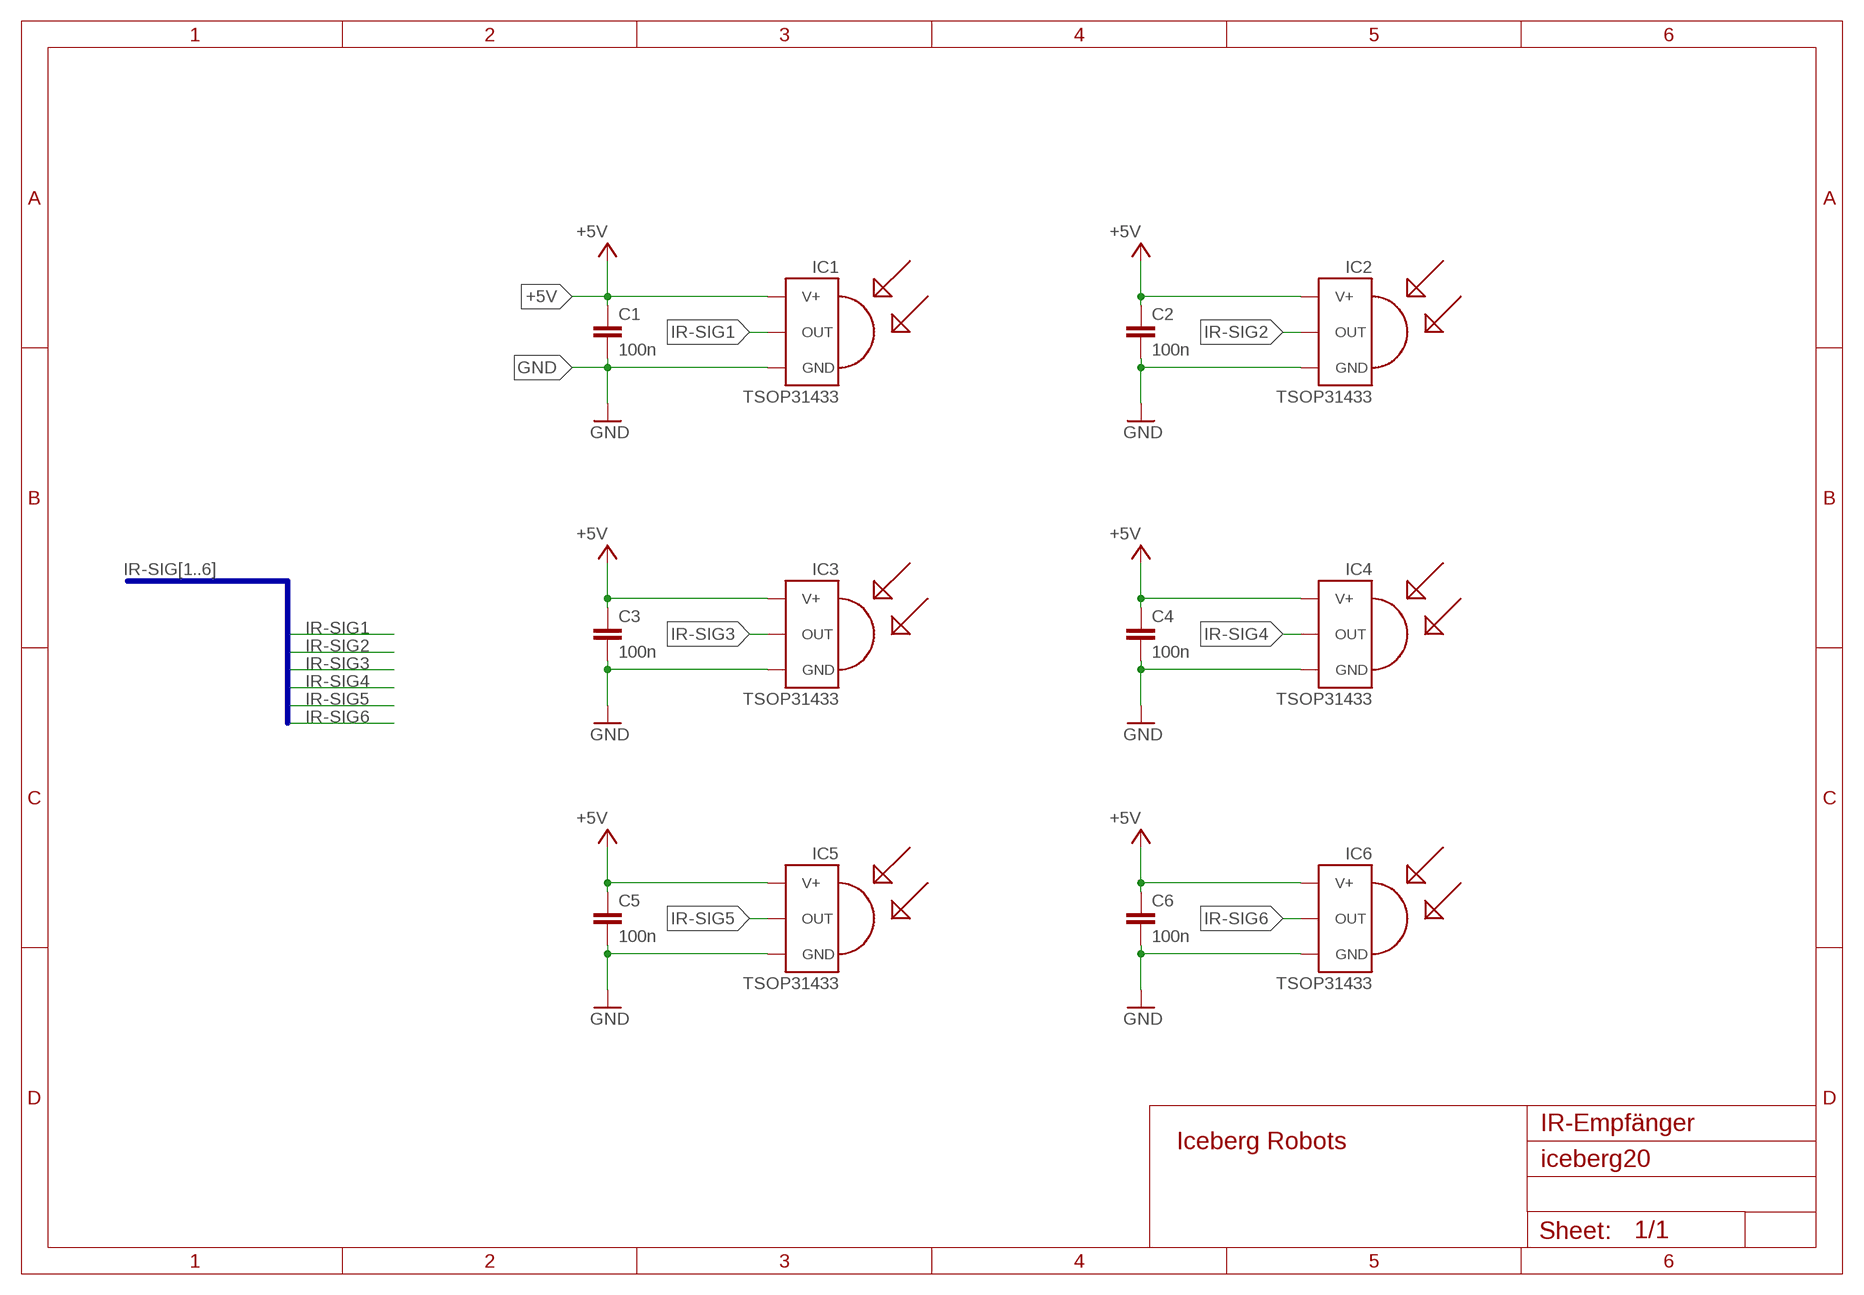
[diagram p10: schematic, module IR-EMPFAENGER, sheet 1]

### Parts
C1  100n  C0805  [C0805]
C2  100n  C0805  [C0805]
C3  100n  C0805  [C0805]
C4  100n  C0805  [C0805]
C5  100n  C0805  [C0805]
C6  100n  C0805  [C0805]
IC1  TSOP31433  [TSOP312]
IC2  TSOP31433  [TSOP312]
IC3  TSOP31433  [TSOP312]
IC4  TSOP31433  [TSOP312]
IC5  TSOP31433  [TSOP312]
IC6  TSOP31433  [TSOP312]

### Nets
+5V: C1.1 C2.1 C3.1 C4.1 C5.1 C6.1 IC1.2(V+) IC2.2(V+) IC3.2(V+) IC4.2(V+) IC5.2(V+) IC6.2(V+)
GND: C1.2 C2.2 C3.2 C4.2 C5.2 C6.2 IC1.1(GND) IC2.1(GND) IC3.1(GND) IC4.1(GND) IC5.1(GND) IC6.1(GND)
IR-SIG1: IC1.3(OUT)
IR-SIG2: IC2.3(OUT)
IR-SIG3: IC3.3(OUT)
IR-SIG4: IC4.3(OUT)
IR-SIG5: IC5.3(OUT)
IR-SIG6: IC6.3(OUT)

### Buses
IR-SIG[1..6]

### Notes on the sheet
- IR-Empfänger

### Library data of the parts
C1-C6 = iceberg20:C: Capacitor, SMD 0805, Value wird festgelegt; BESTAND: -; HERSTELLER: -; HERSTELLER-NR: -; SUPPLIER: -; SUPPLIER-NR: -; TOLERANZ: 10%; V-MAX: 20V
IC1-IC6 = iceberg20:TSOP31433: IR-Receiver 33kHz Datenblatt: Link <https://eu.mouser.com/datasheet/2/427/tsop312-537288.pdf>; BESTAND: ?; HERSTELLER: Vishay Semiconductors; HERSTELLER-NR: TSOP31433; SUPPLIER: Mouser; SUPPLIER-NR: 78-TSOP31433

## Module BLUETOOTH
Ports: +5V(pwr) GND(pwr) RX(in) TX(out) EN-B(in) STATE-B(out)
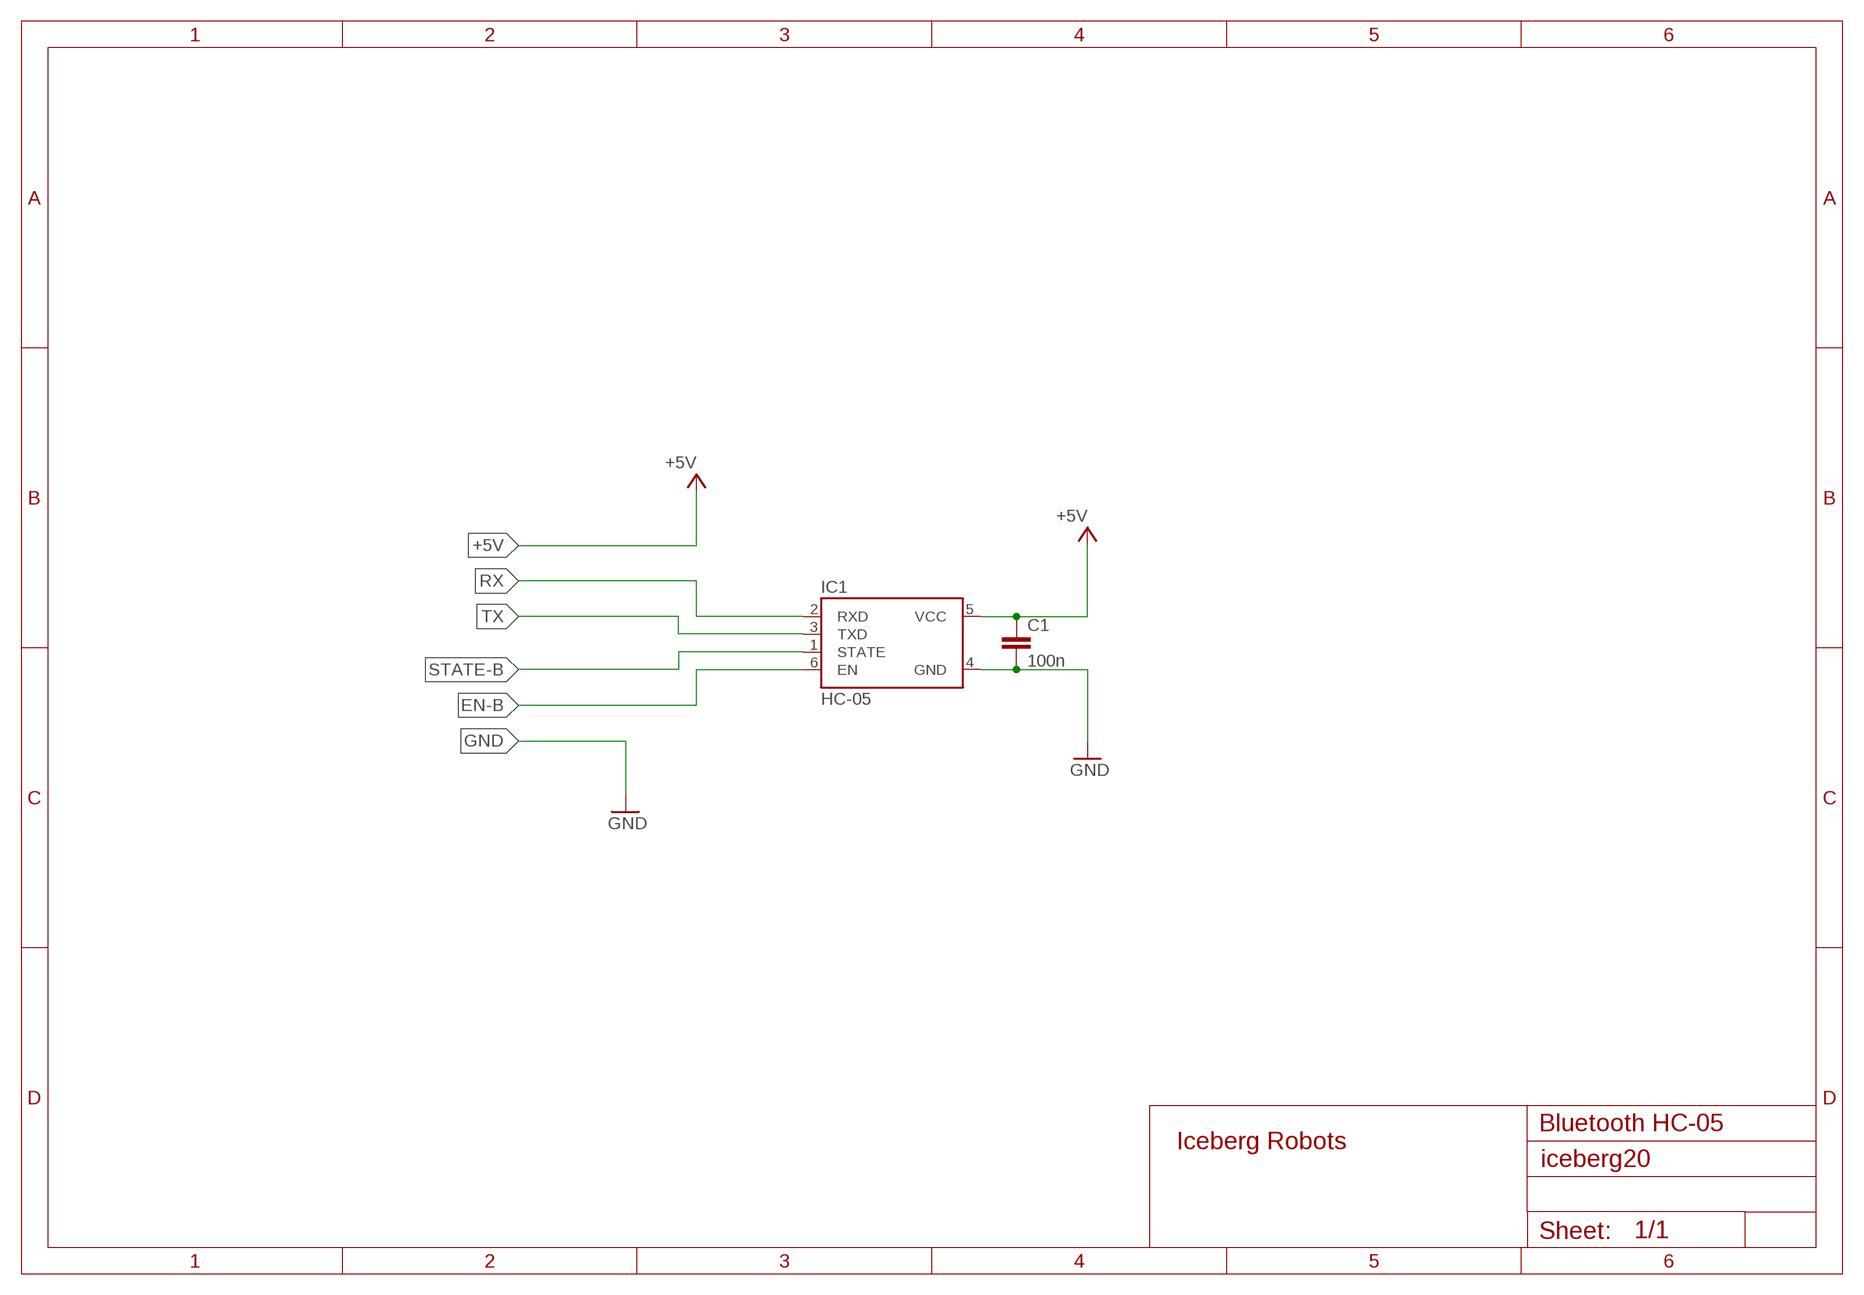
[diagram p11: schematic, module BLUETOOTH, sheet 1]

### Parts
C1  100n  C0805  [C0805]
IC1  HC-05  [HC-05]

### Nets
+5V: C1.1 IC1.5(VCC)
EN-B: IC1.6(EN)
GND: C1.2 IC1.4(GND)
RX: IC1.2(RXD)
STATE-B: IC1.1(STATE)
TX: IC1.3(TXD)

### Notes on the sheet
- Bluetooth HC-05

### Library data of the parts
C1 = iceberg20:C: Capacitor, SMD 0805, Value wird festgelegt; BESTAND: -; HERSTELLER: -; HERSTELLER-NR: -; SUPPLIER: -; SUPPLIER-NR: -; TOLERANZ: 10%; V-MAX: 20V
IC1 = iceberg20:HC-05: Bluetooth Modul Datenblatt1: Link <https://cdn.shopify.com/s/files/1/1509/1638/files/HC-05_Wireless_Bluetooth_Transceiver_Modul_fur_Arduino_Datenblatt.pdf?14386780967915088289> Datenballt2: Link <https://components101.com/wireless/hc-05-bluetooth-module>; BESTAND: ?

## Module SENSOREN
Ports: +5V(pwr) GND(pwr) BR-O(out) SCL(io) SDA(io) BR-LED(in) PHOTO(out) TEMP(io)
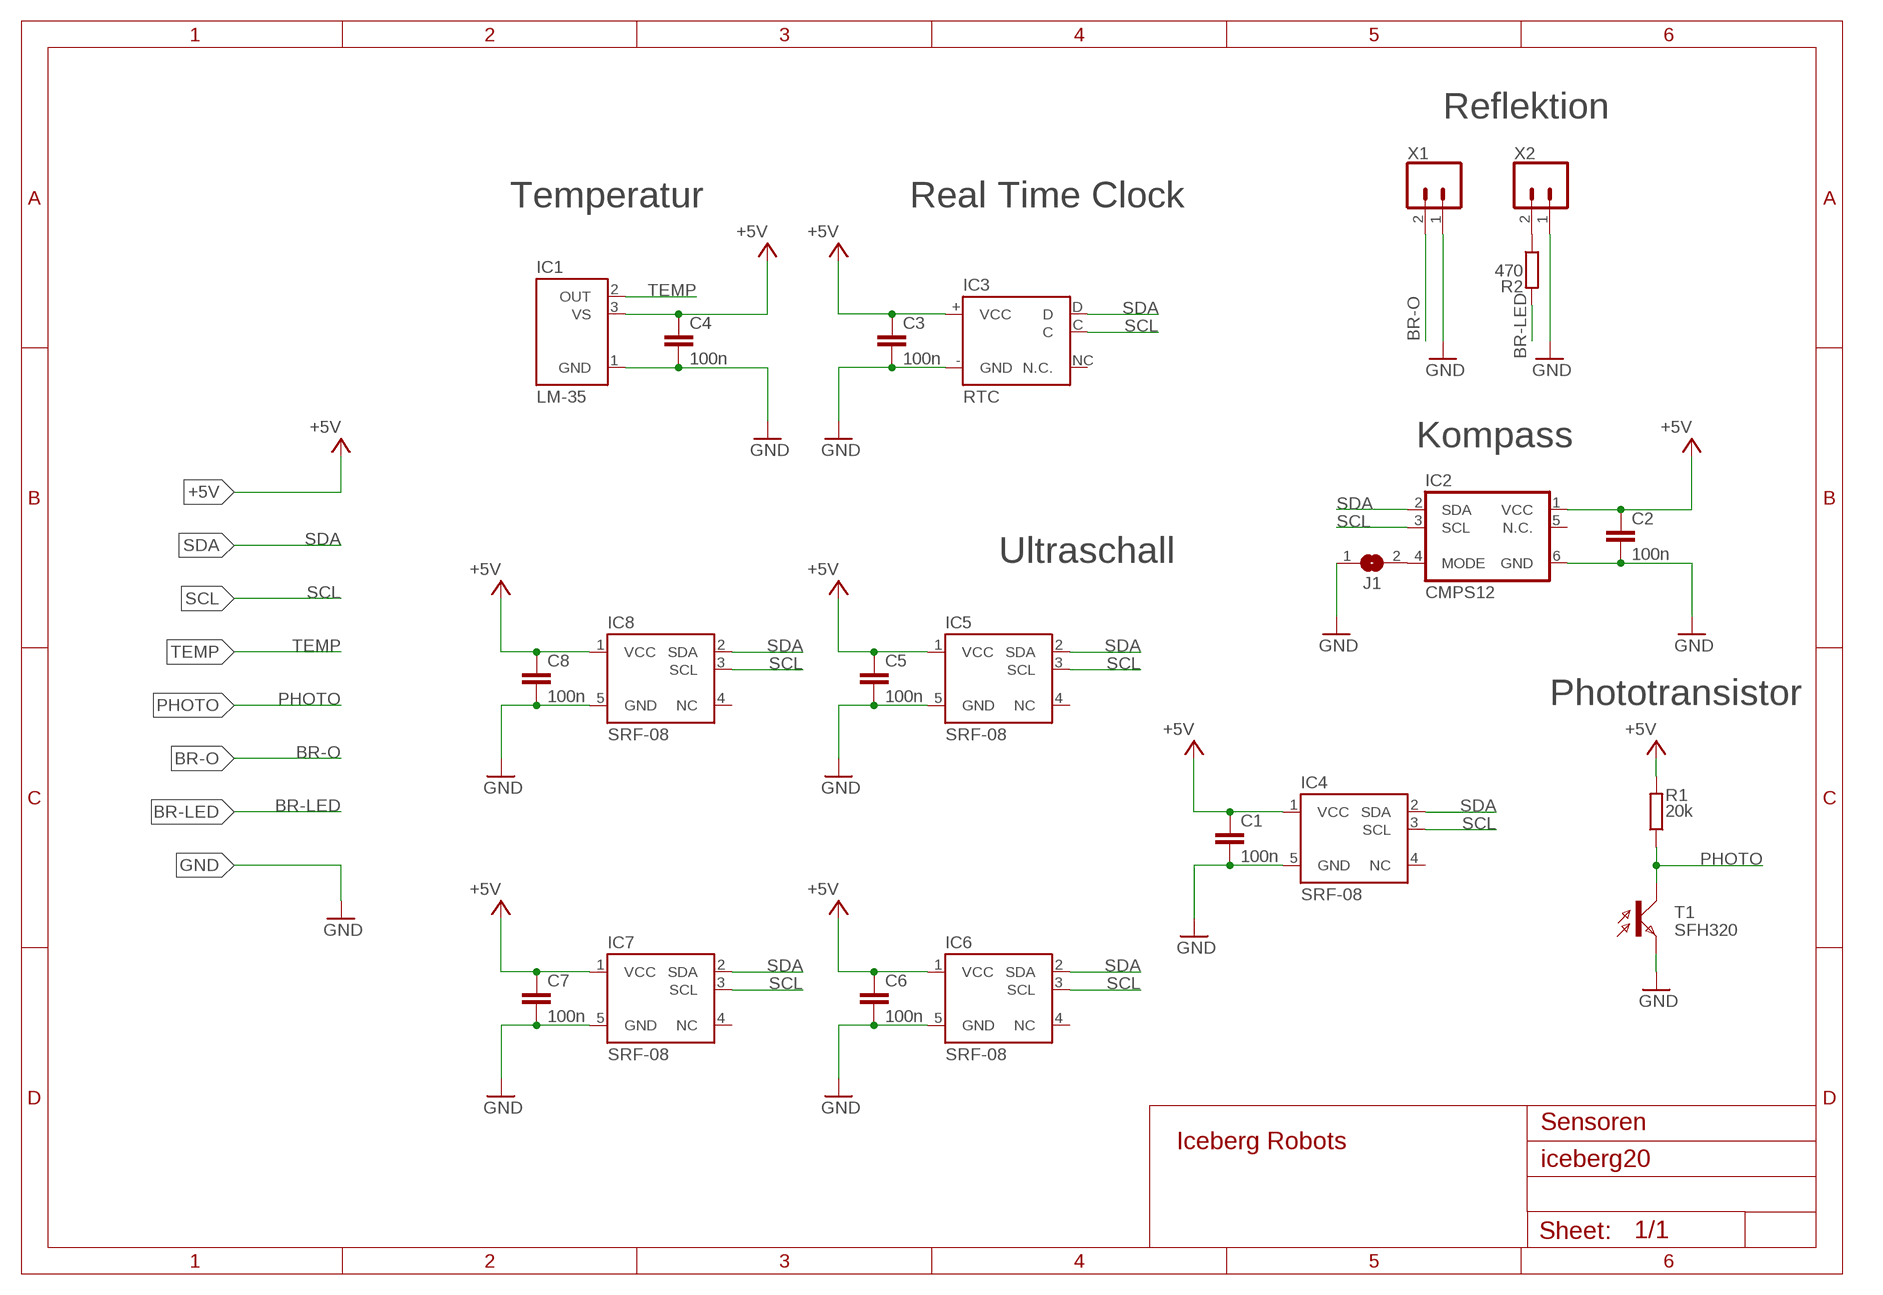
[diagram p12: schematic, module SENSOREN, sheet 1]

### Parts
C1  100n  C0805  [C0805]
C2  100n  C0805  [C0805]
C3  100n  C0805  [C0805]
C4  100n  C0805  [C0805]
C5  100n  C0805  [C0805]
C6  100n  C0805  [C0805]
C7  100n  C0805  [C0805]
C8  100n  C0805  [C0805]
IC1  LM-35  [TO-92]
IC2  CMPS12  [CMPS12]
IC3  RTC  [RTC]
IC4  SRF-08  [SRF-08]
IC5  SRF-08  [SRF-08]
IC6  SRF-08  [SRF-08]
IC7  SRF-08  [SRF-08]
IC8  SRF-08  [SRF-08]
J1  JUMPER-2  [SJ]
R1  20k  R  [R0805]
R2  470  R  [R0805]
T1  SFH320  [PLCC-2]
X1  PS25/2GPS25/2GWS-1X02  [CON-01X02]
X2  PS25/2GPS25/2GWS-1X02  [CON-01X02]

### Nets
+5V: C1.1 C2.1 C3.1 C4.1 C5.1 C6.1 C7.1 C8.1 IC1.3(VS) IC2.1(VCC) IC3.+(VCC) IC4.1(VCC) IC5.1(VCC) IC6.1(VCC) IC7.1(VCC) IC8.1(VCC) R1.2
BR-LED: R2.2
BR-O: X1.2
GND: C1.2 C2.2 C3.2 C4.2 C5.2 C6.2 C7.2 C8.2 IC1.1(GND) IC2.6(GND) IC3.-(GND) IC4.5(GND) IC5.5(GND) IC6.5(GND) IC7.5(GND) IC8.5(GND) J1.1 T1.C(E) X2.1
N$1: IC2.4(MODE) J1.2
N$2: R2.1 X2.2
N$3: X1.1 ; supply symbol labelled GND
PHOTO: R1.1 T1.A(C)
SCL: IC2.3(SCL) IC3.C IC4.3(SCL) IC5.3(SCL) IC6.3(SCL) IC7.3(SCL) IC8.3(SCL)
SDA: IC2.2(SDA) IC3.D IC4.2(SDA) IC5.2(SDA) IC6.2(SDA) IC7.2(SDA) IC8.2(SDA)
TEMP: IC1.2(OUT)
Unconnected: IC2.5(N.C.) IC3.NC(N.C.) IC4.4(NC) IC5.4(NC) IC6.4(NC) IC7.4(NC) IC8.4(NC)

### Notes on the sheet
- Reflektion
- Temperatur | Real Time Clock
- Kompass
- Ultraschall
- Phototransistor
- Sensoren

### Library data of the parts
C1-C8 = iceberg20:C: Capacitor, SMD 0805, Value wird festgelegt; BESTAND: -; HERSTELLER: -; HERSTELLER-NR: -; SUPPLIER: -; SUPPLIER-NR: -; TOLERANZ: 10%; V-MAX: 20V
IC1 = iceberg20:LM-35: Temperatursensor LM35 TO-92, 4V - 30V, -55°C - 150°C Datenblatt: Link <http://www.ti.com/lit/ds/symlink/lm35.pdf>; BESTAND: ?; HERSTELLER: MikroElektronika ODER TI; HERSTELLER-NR: MIKROE-912 ODER LM35*Z/*; SUPPLIER: Bürklin; SUPPLIER-NR: 74S4560
IC2 = iceberg20:CMPS12: Kompass, Magnetomter, Gyro, Accelometer, 3,3V -5VDatenblatt: Link <https://www.robot-electronics.co.uk/files/cmps12.pdf>; BESTAND: ?; HERSTELLER: -; HERSTELLER-NR: -; SUPPLIER: -; SUPPLIER-NR: -
IC3 = iceberg20:RTC: RTC Modul, I2C, Integrierter Akku Datenblatt: Link <https://datasheets.maximintegrated.com/en/ds/DS3231.pdf>; BESTAND: 2; HERSTELLER: div.; HERSTELLER-NR: "DS3231 for PI" Modul; SUPPLIER: -; SUPPLIER-NR: -
IC4-IC8 = iceberg20:SRF-08: Ultraschallsensor, 5V, 3 - 600cm Datenblatt: Link <http://coecsl.ece.illinois.edu/ge423/DevantechSRF08UltraSonicRanger.pdf>; BESTAND: 12; HERSTELLER: Devantech; HERSTELLER-NR: SRF-08; SUPPLIER: -; SUPPLIER-NR: -
J1 = iceberg20:JUMPER-2: Jumper, zwei Pads Datenblatt: Link; BESTAND: n.z.; HERSTELLE-NR: n.z.; HERSTELLER: n.z.; SUPPLIER: n.z.; SUPPLIER-NR: n.z.
R1 R2 = iceberg20:R: Resistor, SMD 0805, Value wird festgelegt; BESTAND: -; HERSTELLER: -; HERSTELLER-NR: -; SUPPLIER: -; SUPPLIER-NR: -; TOLERANZ: 5%
T1 = iceberg20:SFH320: SFH 320-Z, 5V, 450 - 1150 nm Datenblatt: Link <https://www.osram.com/ecat/TOPLED%c2%ae%20SFH%20320/com/en/class_pim_web_catalog_103489/global/prd_pim_device_2219665/>; BESTAND: 40; HERSTELLER: Osram Opto Semi; HESTELLER-NR: SFH320; SUPLLIER: Bürklin; SUPPLIER-NR: 68S3158
X1 X2 = iceberg20:PS25/2G: PS 25/2G WS Platinensteckverbinder gerade, weiß, 2-polig Datenblatt: Link; SUPPLIER: Reichelt; SUPPLIER-NR: PS 25/2G WS

## Module ENCODER
Ports: SCL(io) SDA(io) GND(pwr) ENA[0..3](in) ENB[0..3](in) +5V(pwr)
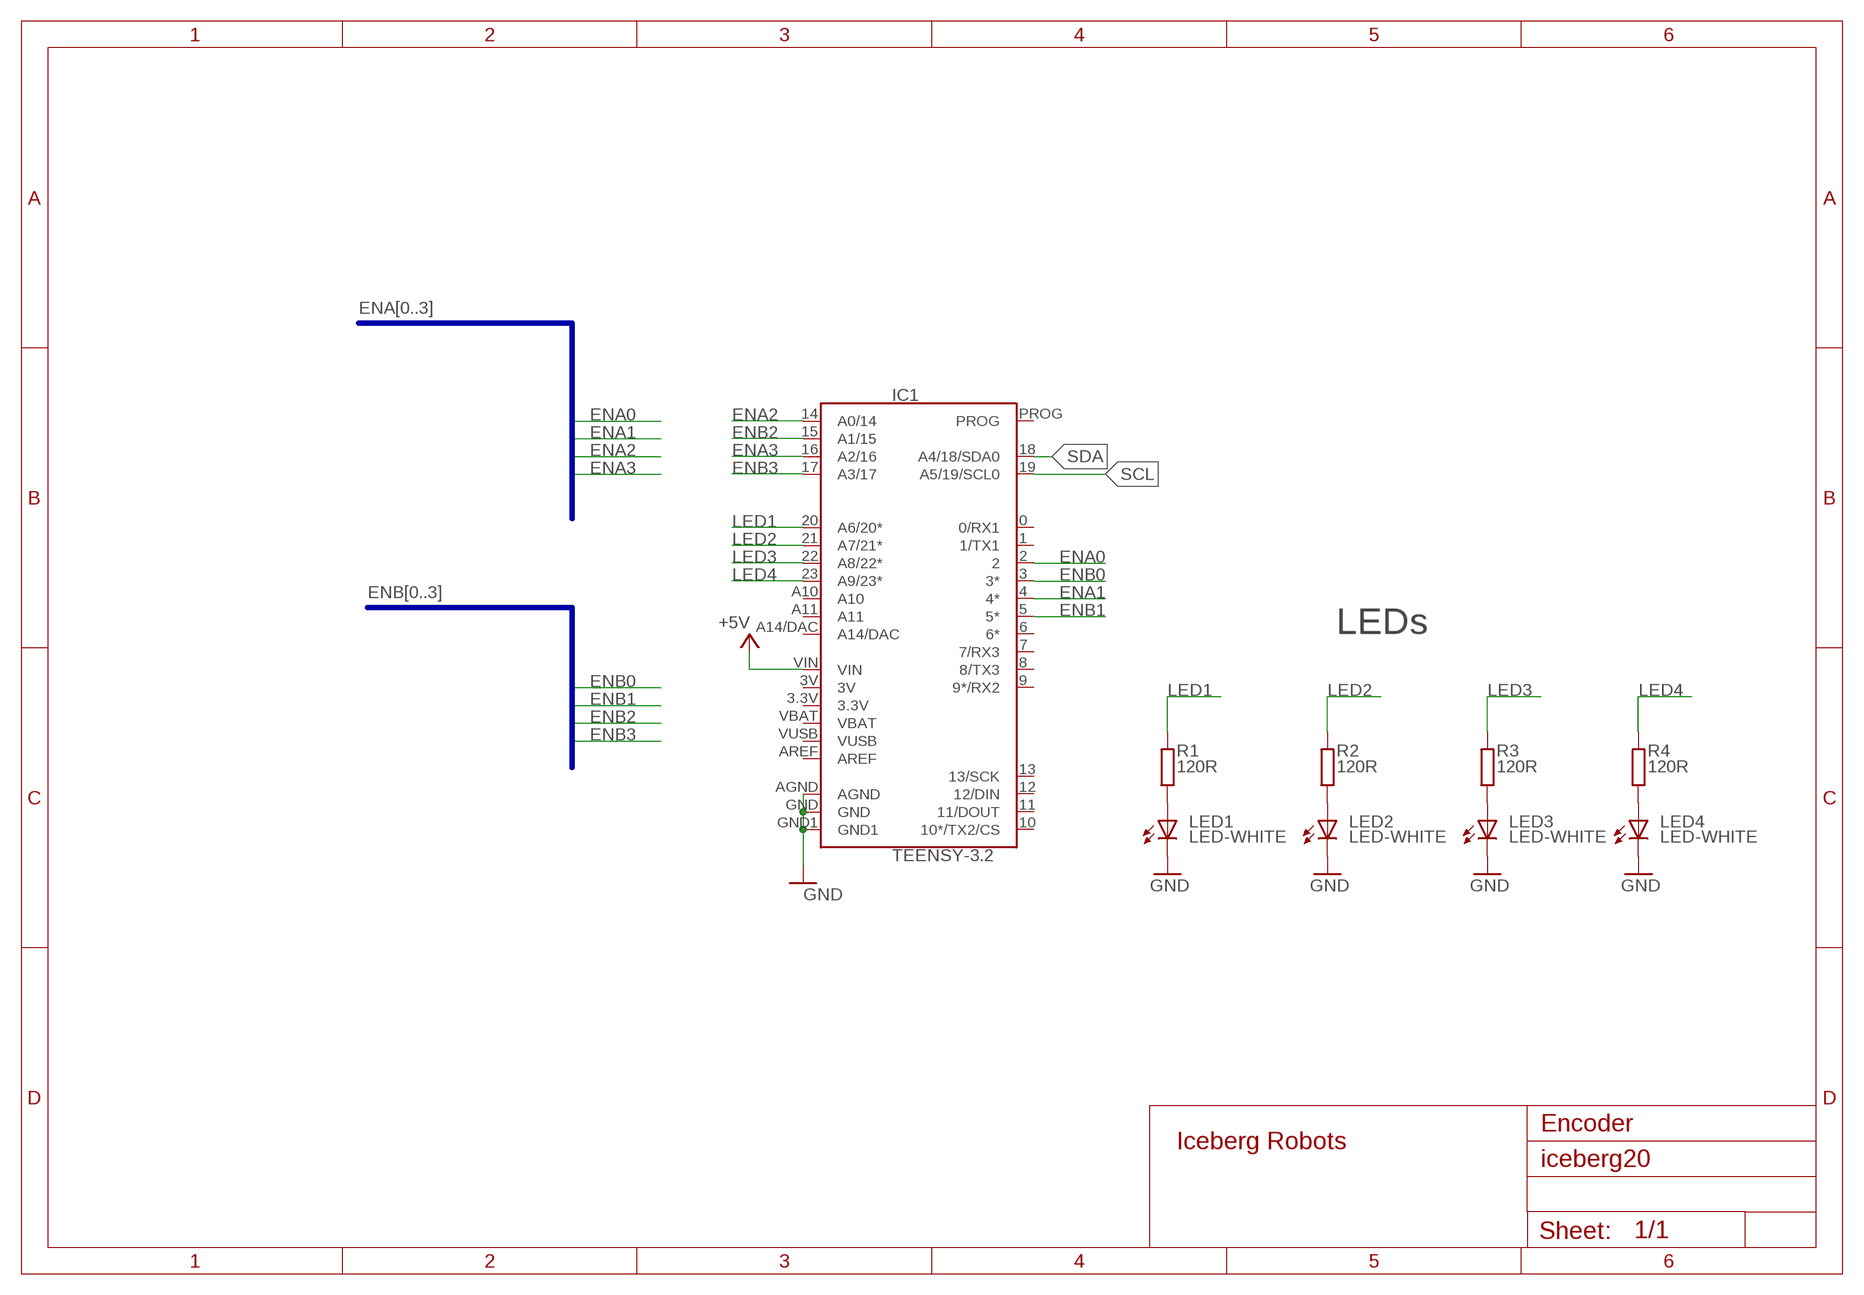
[diagram p13: schematic, module ENCODER, sheet 1]

### Parts
IC1  TEENSY-3.2  [TEENSY-3]
LED1  LED-WHITE  [PLCC-2]
LED2  LED-WHITE  [PLCC-2]
LED3  LED-WHITE  [PLCC-2]
LED4  LED-WHITE  [PLCC-2]
R1  120R  R  [R0805]
R2  120R  R  [R0805]
R3  120R  R  [R0805]
R4  120R  R  [R0805]

### Nets
+5V: IC1.VIN
ENA0: IC1.2
ENA1: IC1.4(4*)
ENA2: IC1.14(A0/14)
ENA3: IC1.16(A2/16)
ENB0: IC1.3(3*)
ENB1: IC1.5(5*)
ENB2: IC1.15(A1/15)
ENB3: IC1.17(A3/17)
GND: IC1.AGND IC1.GND IC1.GND1 LED1.C LED2.C LED3.C LED4.C
LED1: IC1.20(A6/20*) R1.2
LED2: IC1.21(A7/21*) R2.2
LED3: IC1.22(A8/22*) R3.2
LED4: IC1.23(A9/23*) R4.2
N$3: LED1.A R1.1
N$4: LED2.A R2.1
N$5: LED3.A R3.1
N$8: LED4.A R4.1
SCL: IC1.19(A5/19/SCL0)
SDA: IC1.18(A4/18/SDA0)
Unconnected: IC1.0(0/RX1) IC1.1(1/TX1) IC1.6(6*) IC1.7(7/RX3) IC1.8(8/TX3) IC1.9(9*/RX2) IC1.10(10*/TX2/CS) IC1.11(11/DOUT) IC1.12(12/DIN) IC1.13(13/SCK) IC1.A10 IC1.A11 IC1.A14/DAC IC1.AREF IC1.PROG

### Buses
ENA[0..3]
ENB[0..3]

### Notes on the sheet
- LEDs
- Encoder

### Power pins joined to a net without a drawn wire
3.3V: IC1.3.3V
3V: IC1.3V
VBAT: IC1.VBAT
VUSB: IC1.VUSB

### Library data of the parts
IC1 = iceberg20:TEENSY-3.2: TEENSY 3.2 Teensy 3.2, USB Pinübersicht: Link <https://cdn-reichelt.de/documents/datenblatt/A300/TEENSY3.2A.pdf> Detailübersicht: Link <https://cdn-reichelt.de/documents/datenblatt/A300/TEENSYDETAILBERSICHT.pdf> Datenblatt: Link <http://dlnmh9ip6v2uc.cloudfront.net/datasheets/Dev/Arduino/Boards/K20P64M72SF1.pdf>; BESTAND: 0; HERSTELLER: PJRC; HERSTELLER-NR: Teensy32; SUPPLIER: Reichelt; SUPPLIER-NR: TEENSY 3.2
LED1-LED4 = iceberg20:LED-WHITE: LED, PLCC-2Datenblatt: Link <https://datasheet.octopart.com/LWT67C-T2U2-5K8L-Z-Osram-datasheet-514127.pdf>; BESTAND: 15; HERSTELLER: Osram Opto Semi; HERSTELLER-NR: LWT67C-T2U2-5K8L-Z; SUPPLIER: Bürklin; SUPPLIER-NR: 66S9826
R1-R4 = iceberg20:R: Resistor, SMD 0805, Value wird festgelegt; BESTAND: -; HERSTELLER: -; HERSTELLER-NR: -; SUPPLIER: -; SUPPLIER-NR: -; TOLERANZ: 5%

## Module EIN/AUSGABE
Ports: +5V(pwr) GND(pwr) HEARTBEAT(in) SPEAKER(in) SWITCH(out) LED3(in) LED2(in) LED1(in)
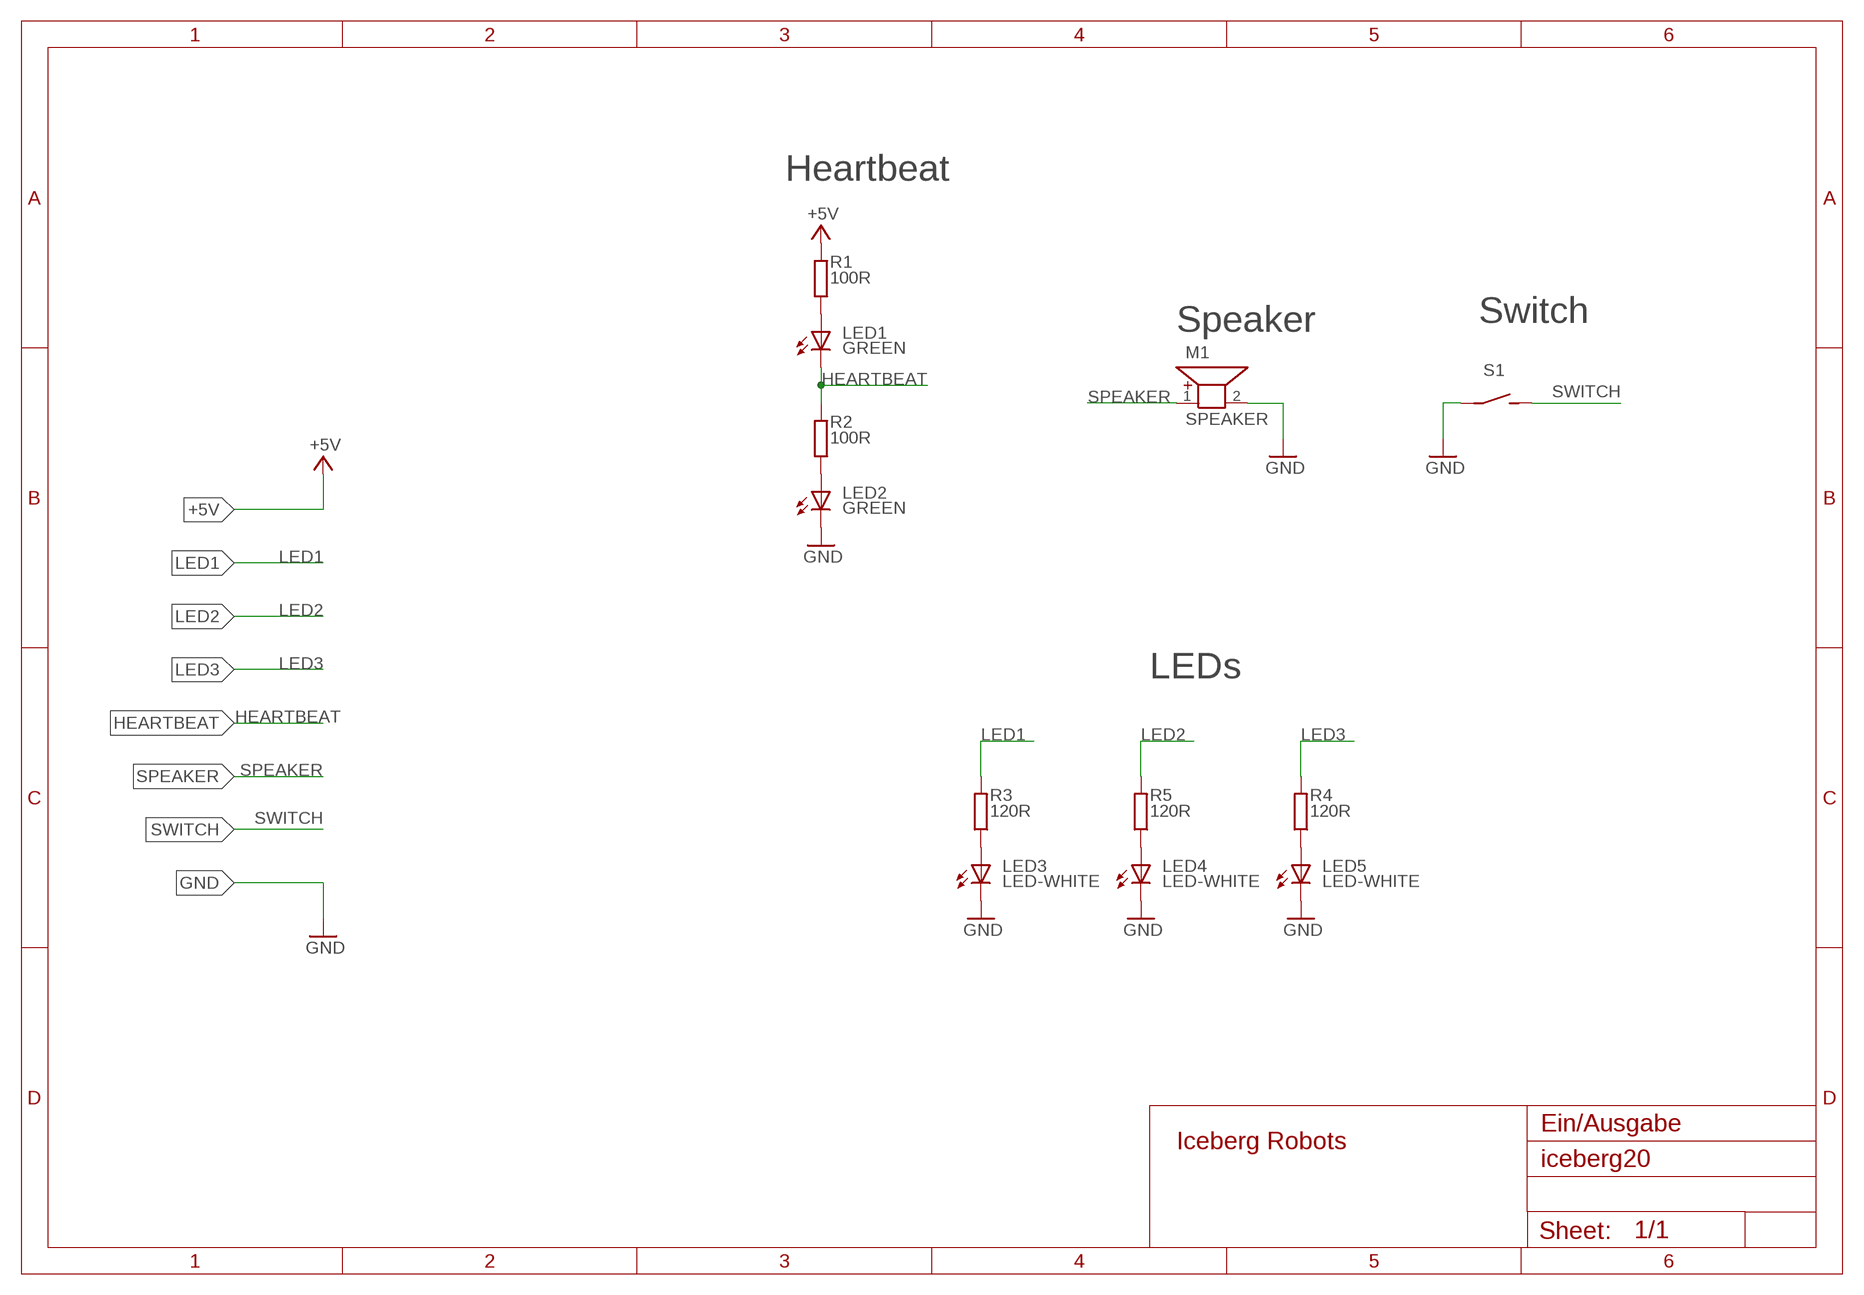
[diagram p14: schematic, module EIN/AUSGABE, sheet 1]

### Parts
LED1  GREEN  LED-GREEN  [PLCC-2]
LED2  GREEN  LED-GREEN  [PLCC-2]
LED3  LED-WHITE  [PLCC-2]
LED4  LED-WHITE  [PLCC-2]
LED5  LED-WHITE  [PLCC-2]
M1  SPEAKER  [SPEAKER]
R1  100R  R  [R0805]
R2  100R  R  [R0805]
R3  120R  R  [R0805]
R4  120R  R  [R0805]
R5  120R  R  [R0805]
S1  SWITCH  [1801.2106]

### Nets
+5V: R1.2
GND: LED2.C LED3.C LED4.C LED5.C M1.2 S1.1(P)
HEARTBEAT: LED1.C R2.2
LED1: R3.2
LED2: R5.2
LED3: R4.2
N$1: LED1.A R1.1
N$2: LED2.A R2.1
N$3: LED3.A R3.1
N$4: LED4.A R5.1
N$5: LED5.A R4.1
SPEAKER: M1.1
SWITCH: S1.2(S)

### Notes on the sheet
- Heartbeat
- Speaker | Switch
- LEDs
- Ein/Ausgabe

### Library data of the parts
LED1 LED2 = iceberg20:LED-GREEN: LED, PLCC-2Datenblatt: Link <https://www.mouser.de/datasheet/2/311/LP%20T675%20-%20TOPLED-364758.pdf>; BESTAND: ?; HERSTELLER: Osram Opto Semi; HERSTELLER-NR: LPT675-N1P2-25-Z; SUPPLIER: Bürklin; SUPPLIER-NR: 66S9720
LED3-LED5 = iceberg20:LED-WHITE: LED, PLCC-2Datenblatt: Link <https://datasheet.octopart.com/LWT67C-T2U2-5K8L-Z-Osram-datasheet-514127.pdf>; BESTAND: 15; HERSTELLER: Osram Opto Semi; HERSTELLER-NR: LWT67C-T2U2-5K8L-Z; SUPPLIER: Bürklin; SUPPLIER-NR: 66S9826
M1 = iceberg20:SPEAKER: Miniaturlautsprecher, 85 dB, 500 Hz - 6kHz Datenblatt: Link <http://www-neu.digisound.de//wp-content/uploads/2015/05/F-SWX06.pdf>; BESTAND: ?; HERSTELLER: Digisound; HERSTELLER-NR: F/SWX06; SUPPLIER: Bürklin; SUPPLIER-NR: 38M212
R1-R5 = iceberg20:R: Resistor, SMD 0805, Value wird festgelegt; BESTAND: -; HERSTELLER: -; HERSTELLER-NR: -; SUPPLIER: -; SUPPLIER-NR: -; TOLERANZ: 5%
S1 = iceberg20:SWITCH: Wippausschalter, schwarz, 1-polig, Ein-Aus Datenblatt: Link <https://www.buerklin.com/medias/sys_master/root/h4c/ha7/8865562296350/8865562296350.pdf>; BESTAND: 1; HERSTELLER: Marquardt; HERSTELLER-NR: 1801.2106; SUPPLIER: Bürklin; SUPPLIER-NR: 11G2420

## Module ANSCHLUESSE
Ports: +5V(pwr) +12V(pwr) GND(pwr) SDA(io) SCL(io) A1(io) D1(io)
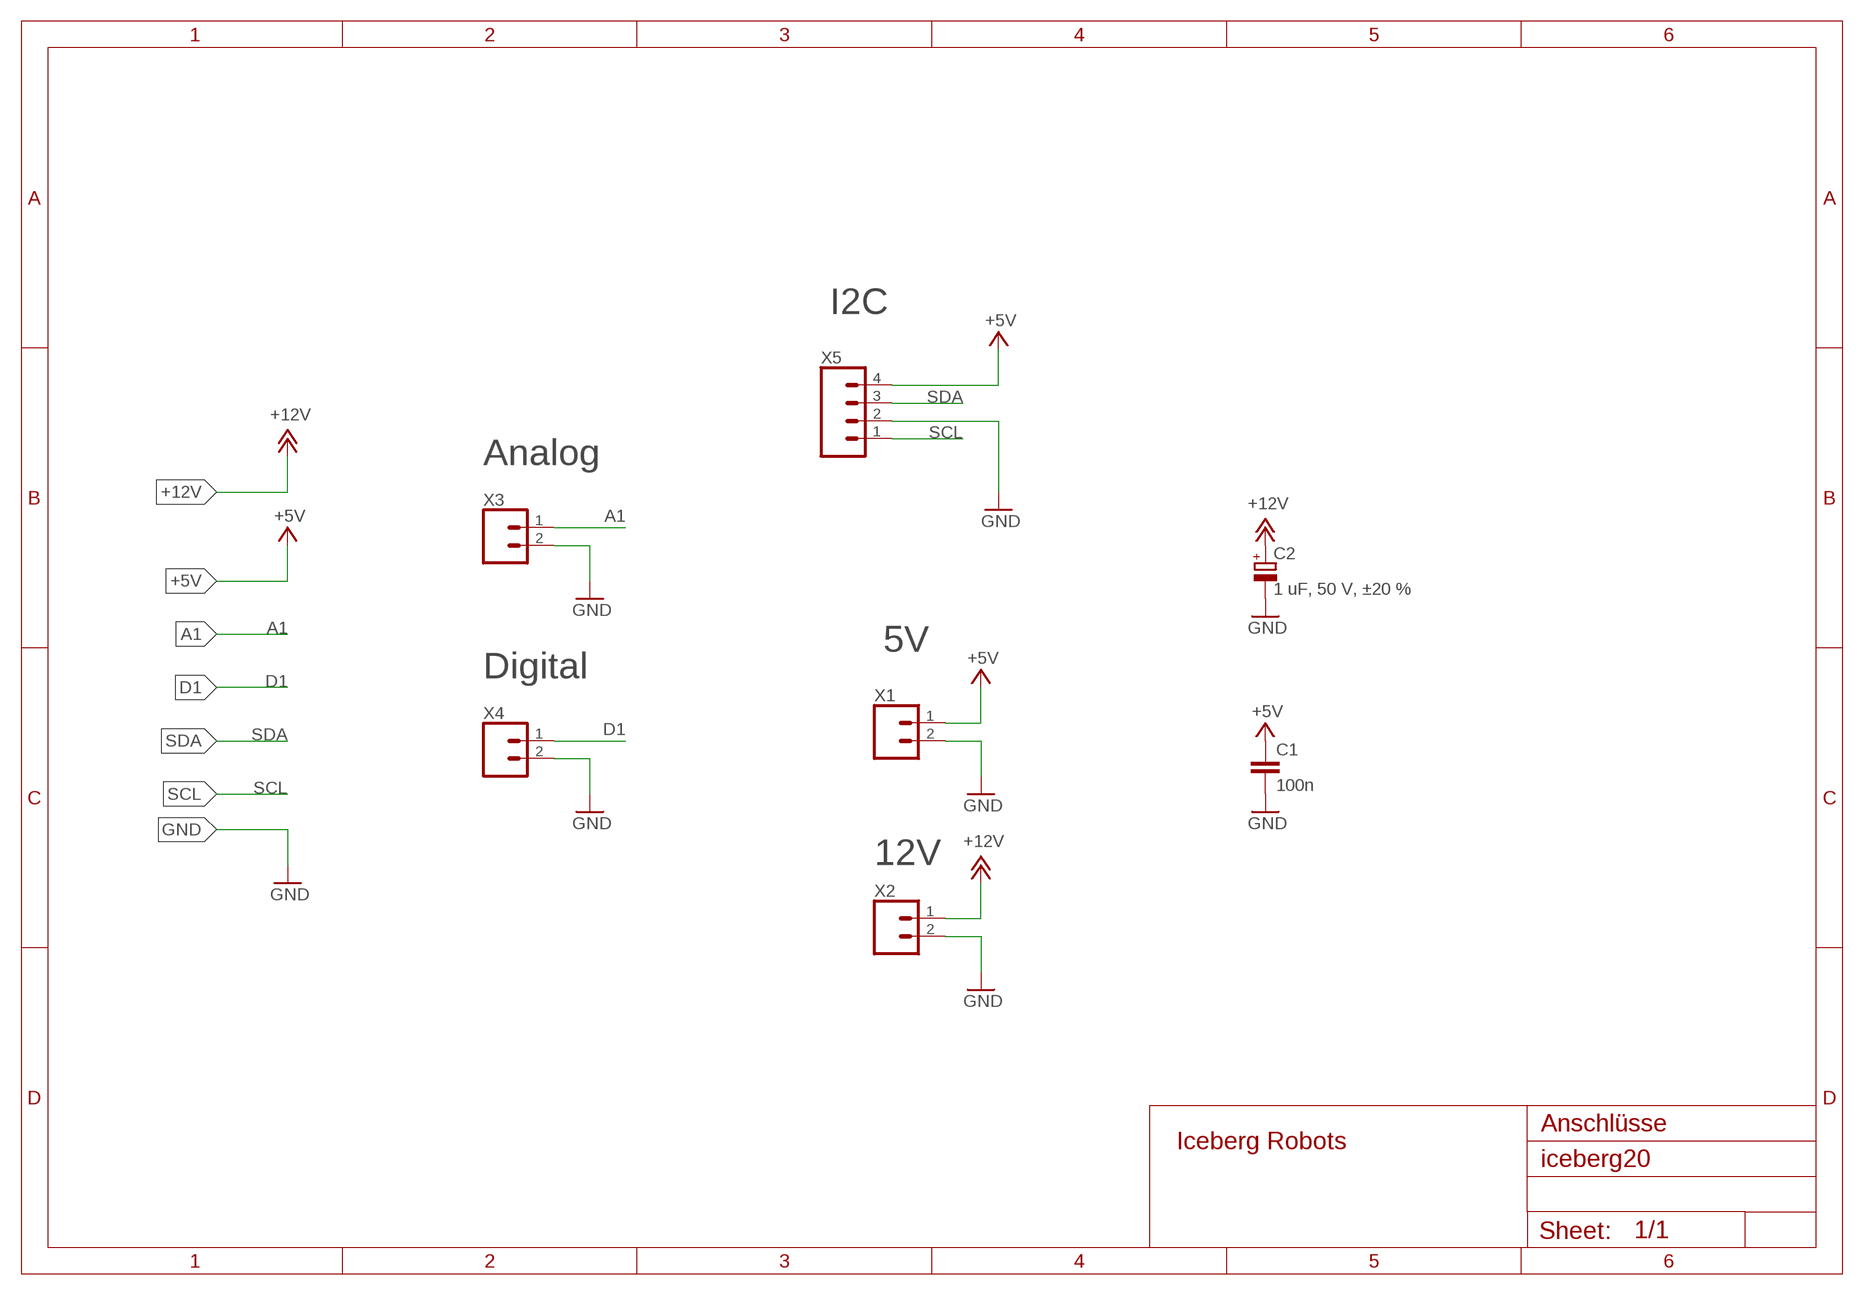
[diagram p15: schematic, module ANSCHLUESSE, sheet 1]

### Parts
C1  100n  C0805  [C0805]
C2  1 uF, 50 V, ±20 %  ELKO-THT-1UF  [CAPACITOR-THT-4]
X1  PS25/2GPS25/2GWS-1X02  [CON-01X02]
X2  PS25/2GPS25/2GWS-1X02  [CON-01X02]
X3  PS25/2GPS25/2GWS-1X02  [CON-01X02]
X4  PS25/2GPS25/2GWS-1X02  [CON-01X02]
X5  PS25/4G  [CON-01X04]

### Nets
+5V: C1.1 X1.1 X5.4
+12V: C2.1(+) X2.1
A1: X3.1
D1: X4.1
GND: C1.2 C2.2(-) X1.2 X2.2 X3.2 X4.2 X5.2
SCL: X5.1
SDA: X5.3

### Notes on the sheet
- I2C
- Analog
- 5V
- Digital
- 12V
- Anschlüsse

### Library data of the parts
C1 = iceberg20:C: Capacitor, SMD 0805, Value wird festgelegt; BESTAND: -; HERSTELLER: -; HERSTELLER-NR: -; SUPPLIER: -; SUPPLIER-NR: -; TOLERANZ: 10%; V-MAX: 20V
C2 = iceberg20:ELKO: Aluminium-Elko 4,7 µF, 16 V, ±20%, 3x5 mm Datenblatt: Link <https://https://www.buerklin.com/medias/sys_master/root/hc1/h62/8875244388382/8875244388382.pdf>; BESTAND: 10
X1-X4 = iceberg20:PS25/2G: PS 25/2G WS Platinensteckverbinder gerade, weiß, 2-polig Datenblatt: Link; SUPPLIER: Reichelt; SUPPLIER-NR: PS 25/2G WS
X5 = iceberg20:PS25/4G: PS 25/4G WS Platinensteckverbinder gerade, 4-polig Datenblatt: Link <https://www.mouser.de/datasheet/2/418/NG_CD_641126_AA3-1256230.pdf>; BESTAND: 0; HERSTELLER: TE-Connectivity; HERSTELLER-NR: 3-641126-4; SUPPLIER: Mouser; SUPPLIER-NR: 571-3-641126-4

## Module 5V-LINEARWANDLER
Ports: +5V(pwr) +12V(pwr) GND(pwr)
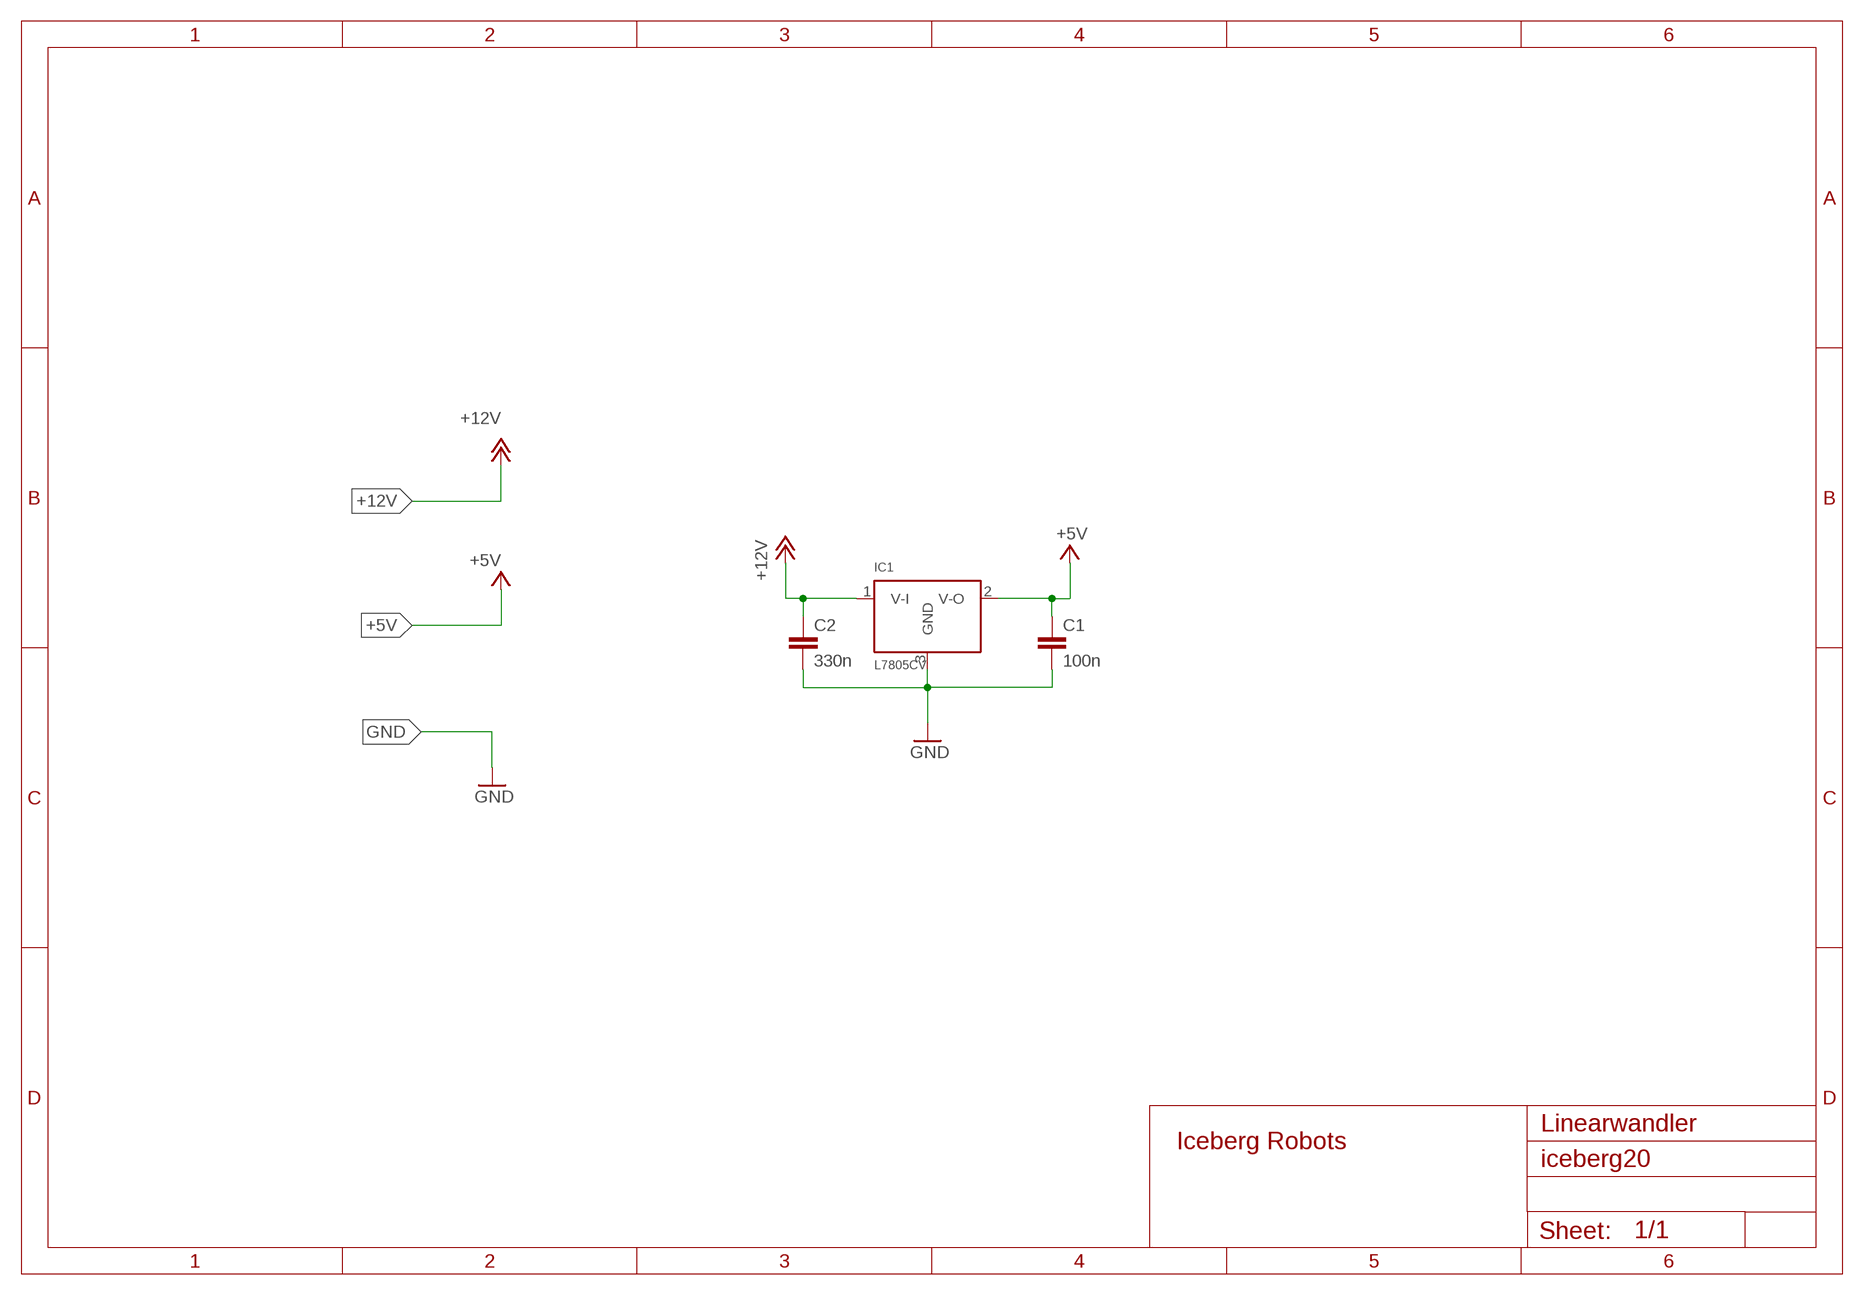
[diagram p16: schematic, module 5V-LINEARWANDLER, sheet 1]

### Parts
C1  100n  C0805  [C0805]
C2  330n  C0805  [C0805]
IC1  L7805CV  [DPAK]

### Nets
+5V: C1.1 IC1.2(V-O)
+12V: C2.1 IC1.1(V-I)
GND: C1.2 C2.2 IC1.3(GND)

### Notes on the sheet
- Linearwandler

### Library data of the parts
C1 C2 = iceberg20:C: Capacitor, SMD 0805, Value wird festgelegt; BESTAND: -; HERSTELLER: -; HERSTELLER-NR: -; SUPPLIER: -; SUPPLIER-NR: -; TOLERANZ: 10%; V-MAX: 20V
IC1 = iceberg20:L7805CV: 5V-Linearwandler Datenblatt: Link <https://cdn-reichelt.de/documents/datenblatt/A200/L7805CV-STM.pdf>; BESTAND: 4

## Module 5V-SCHALTREGLER
Ports: +5V(pwr) +12V(pwr) GND(pwr)
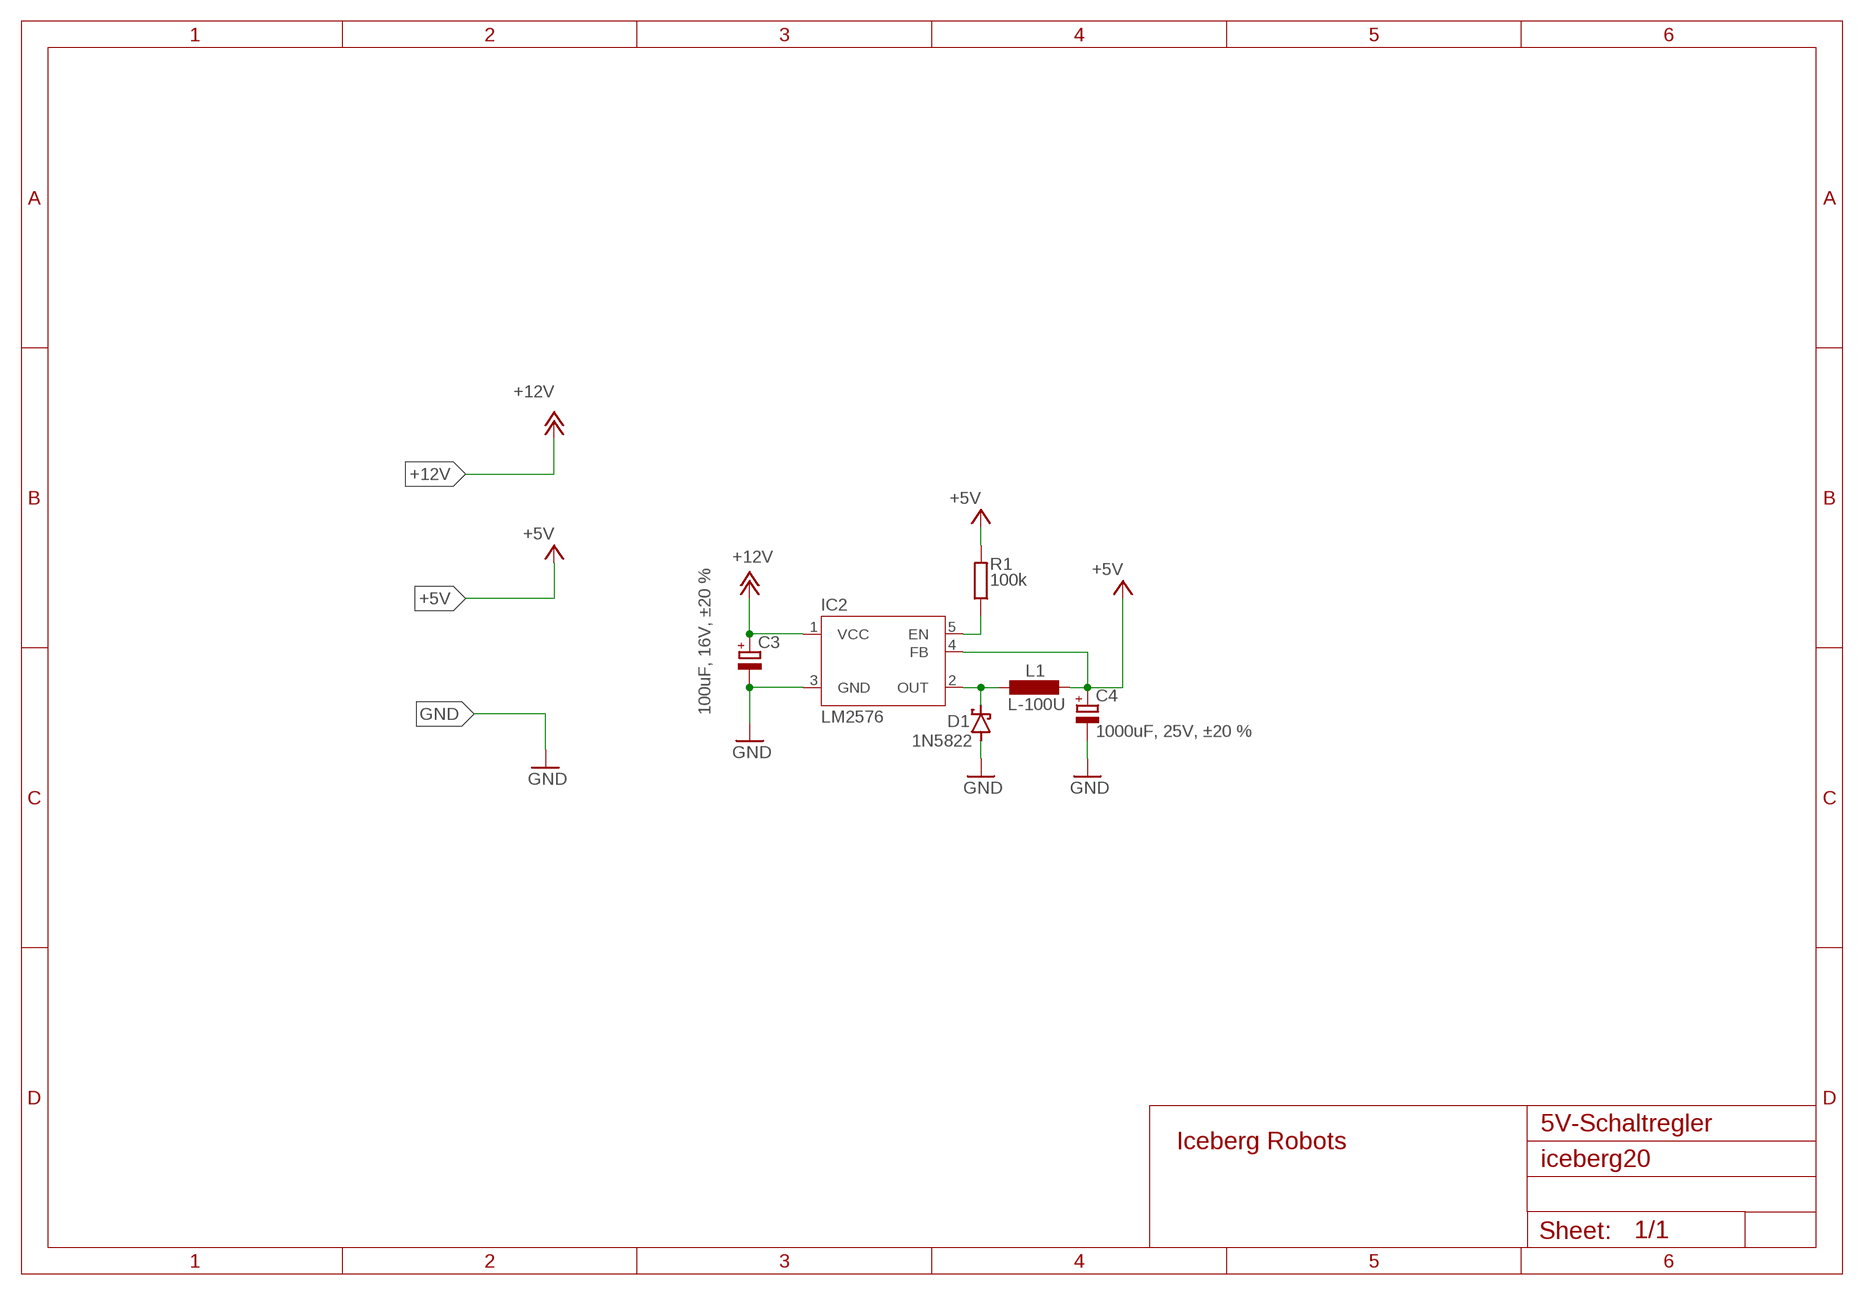
[diagram p17: schematic, module 5V-SCHALTREGLER, sheet 1]

### Parts
C3  100uF, 16V, ±20 %  ELKO-THT-100UF  [CAPACITOR-THT-6.3]
C4  1000uF, 25V, ±20 %  ELKO-THT-1000UF  [CAPACITOR-THT-10]
D1  1N5822  [DO-201AD]
IC2  LM2576  [TO220-5PIN]
L1  L-100U  [PISR]
R1  100k  R  [R0805]

### Nets
+5V: C4.1(+) IC2.4(FB) L1.2 R1.2
+12V: C3.1(+) IC2.1(VCC)
GND: C3.2(-) C4.2(-) D1.2(A) IC2.3(GND)
N$1: IC2.5(EN) R1.1
N$2: D1.1(C) IC2.2(OUT) L1.1

### Notes on the sheet
- 5V-Schaltregler

### Library data of the parts
C3 = iceberg20:ELKO: Aluminium-Elko 4,7 µF, 16 V, ±20%, 3x5 mm Datenblatt: Link <https://https://www.buerklin.com/medias/sys_master/root/hc1/h62/8875244388382/8875244388382.pdf>; BESTAND: 10; HERSTELLER: Teapo; HERSTELLER-NR: KSE107M016S1ABE11K; SUPPLIER: Bürklin; SUPPLIER-NR: 11D5002
C4 = iceberg20:ELKO: Aluminium-Elko 4,7 µF, 16 V, ±20%, 3x5 mm Datenblatt: Link <https://https://www.buerklin.com/medias/sys_master/root/hc1/h62/8875244388382/8875244388382.pdf>; BESTAND: 0; HERSTELLER: Yageo; HERSTELLER-NR: SK025M 1000B 5S-1019; SUPPLIER: Bürklin; SUPPLIER-NR: 11D5310
D1 = iceberg20:1N5822: Schottkydiode, 40 V, 3 A Datenblatt: Link <https://cdn-reichelt.de/documents/datenblatt/A400/1N5820_1N5821_1N5822_CDIL.pdf>; BESTAND: 0; HERSTELLER: LUNSURE; HERSTELLER-NR: 1N5822; SUPPLIER: reichelt; SUPPLIER-NR: 1N 5822
IC2 = iceberg20:LM2576: Step-Down, Buck, 5V, 3A, 4.75-40 VIn Datenblatt: Link <https://cdn-reichelt.de/documents/datenblatt/A200/LM2576T_005G.pdf>; BESTAND: 0; HERSTELLER: ON-SEMICONDUCTOR; HERSTELLER-NR: LM2576T-5G; SUPPLIER: reichelt; SUPPLIER-NR: LM2576T-005
L1 = iceberg20:L-100U: SMD-Power-Induktivität, PISR, Ferrit, 100µ Datenblatt: Link <https://cdn-reichelt.de/documents/datenblatt/B400/PISR.pdf>; BESTAND: 0; HERSTELLER: FASTRON; HERSTELLER-NR: PISR-101M-04; SUPPLIER: reichelt; SUPPLIER-NR: L-PISR 100µ
R1 = iceberg20:R: Resistor, SMD 0805, Value wird festgelegt; BESTAND: -; HERSTELLER: -; HERSTELLER-NR: -; SUPPLIER: -; SUPPLIER-NR: -; TOLERANZ: 5%

## Module ANSCHLUESSE-UNTEN
Ports: +12V(pwr) GND(pwr) ENA[0..3](out) ENB[0..3](out) MA[0..3](in) MB[0..3](in) SCL(io) SDA(io) KICK+(io) KICK-(io) RGBLED(in) INTERRUPT(out) RST-NANO(in) +5V(pwr)
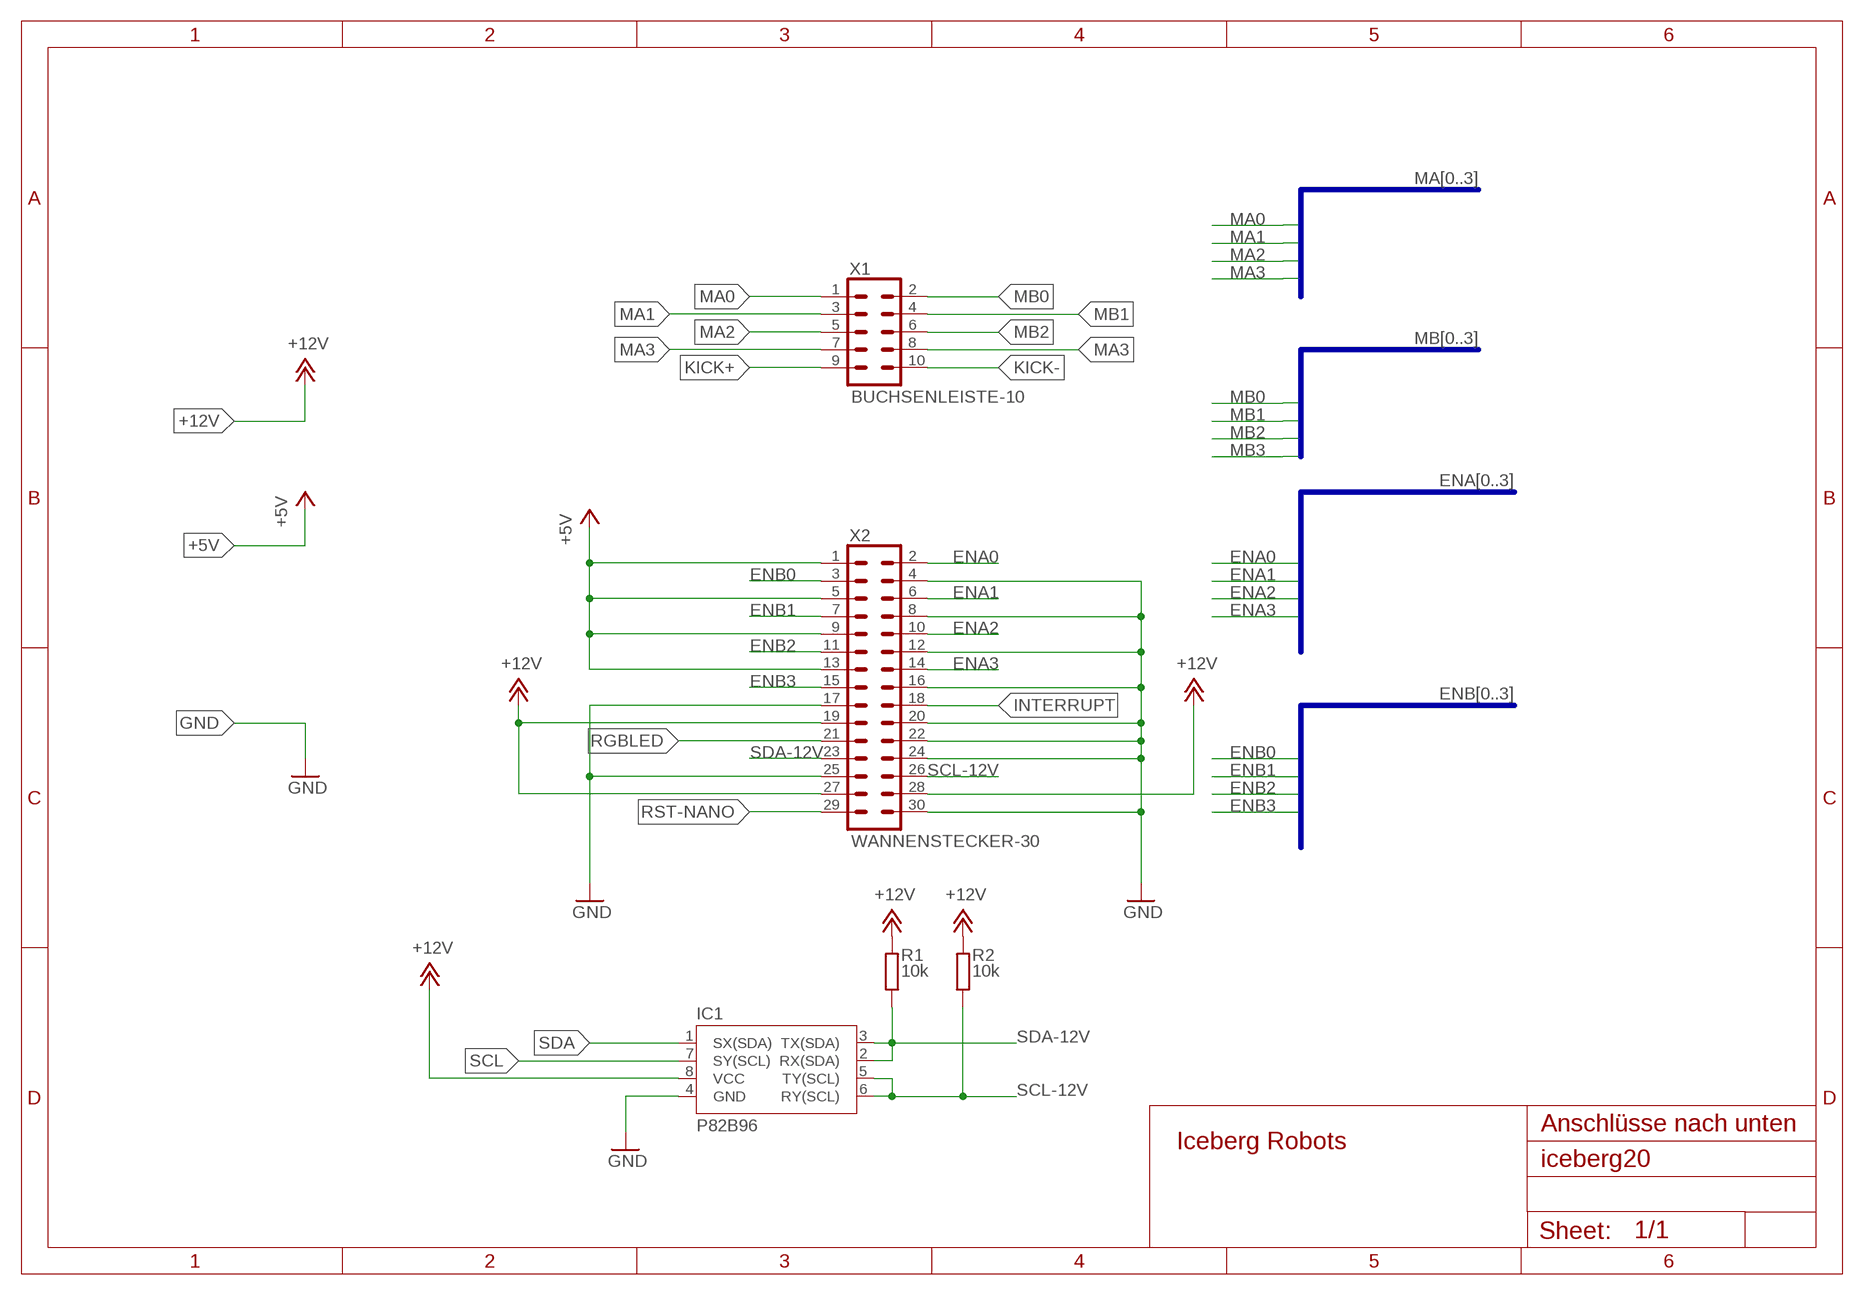
[diagram p18: schematic, module ANSCHLUESSE-UNTEN, sheet 1]

### Parts
IC1  P82B96  [SO8]
R1  10k  R  [R0805]
R2  10k  R  [R0805]
X1  BUCHSENLEISTE-10  [2X5]
X2  WANNENSTECKER-30  [2X15]

### Nets
+5V: X2.1 X2.5 X2.9 X2.13
+12V: IC1.8(VCC) R1.2 R2.2 X2.19 X2.27 X2.28
ENA0: X2.2
ENA1: X2.6
ENA2: X2.10
ENA3: X2.14
ENB0: X2.3
ENB1: X2.7
ENB2: X2.11
ENB3: X2.15
GND: IC1.4(GND) X2.4 X2.8 X2.12 X2.16 X2.17 X2.20 X2.22 X2.24 X2.25 X2.30
INTERRUPT: X2.18
KICK+: X1.9
KICK-: X1.10
MA0: X1.1
MA1: X1.3
MA2: X1.5
MA3: X1.7 X1.8
MB0: X1.2
MB1: X1.4
MB2: X1.6
RGBLED: X2.21
RST-NANO: X2.29
SCL: IC1.7(SY(SCL))
SCL-12V: IC1.5(TY(SCL)) IC1.6(RY(SCL)) R2.1 X2.26
SDA: IC1.1(SX(SDA))
SDA-12V: IC1.2(RX(SDA)) IC1.3(TX(SDA)) R1.1 X2.23

### Buses
ENA[0..3]
ENB[0..3]
MA[0..3]
MB[0..3]

### Notes on the sheet
- Anschlüsse nach unten

### Library data of the parts
IC1 = iceberg20:P82B96: I2C Busbuffer 12V Datenblatt: Link <https://cdn-reichelt.de/documents/datenblatt/A200/P82B96_NXP.pdf>; BESTAND: 0; HERSTELLER: NXP; HERSTELLER-NR: P82B96TD,112; SUPPLIER: reichelt; SUPPLIER-NR: P 82B96 TD
R1 R2 = iceberg20:R: Resistor, SMD 0805, Value wird festgelegt; BESTAND: -; HERSTELLER: -; HERSTELLER-NR: -; SUPPLIER: -; SUPPLIER-NR: -; TOLERANZ: 5%
X1 = iceberg20:BUCHSENLEISTE-10: 10 pin Connector, 2x5, powerDatenblatt: Link <https://www.mouser.de/datasheet/2/276/0430451012_PCB_HEADERS-142935.pdf>; BESTAND: 0; HERSTELLER: Molex; HERSTELLER-NR: 43045-1012; SUPPLIER: Mouser; SUPPLIER-NR: 538-43045-1012
X2 = iceberg20:WANNENSTECKER-30: Wannenstecker, 30-pol, gerade, Rastermaß: 2,54 mm 2x 15-Pol Datenblatt: Link <https://cdn-reichelt.de/documents/datenblatt/C151/101532.pdf>; BESTAND: 0; HERSTELLER: HARTING; HERSTELLER-NR: 09 18 530 6324; SUPPLIER: reichelt; SUPPLIER-NR: HAN 530 6324

## Net classes
1 signal: width 0.254 mm
3 4A: width 1.016 mm
4 6A: width 2.032 mm